# Altium project PLD.PrjPcb (part 1 of 2)
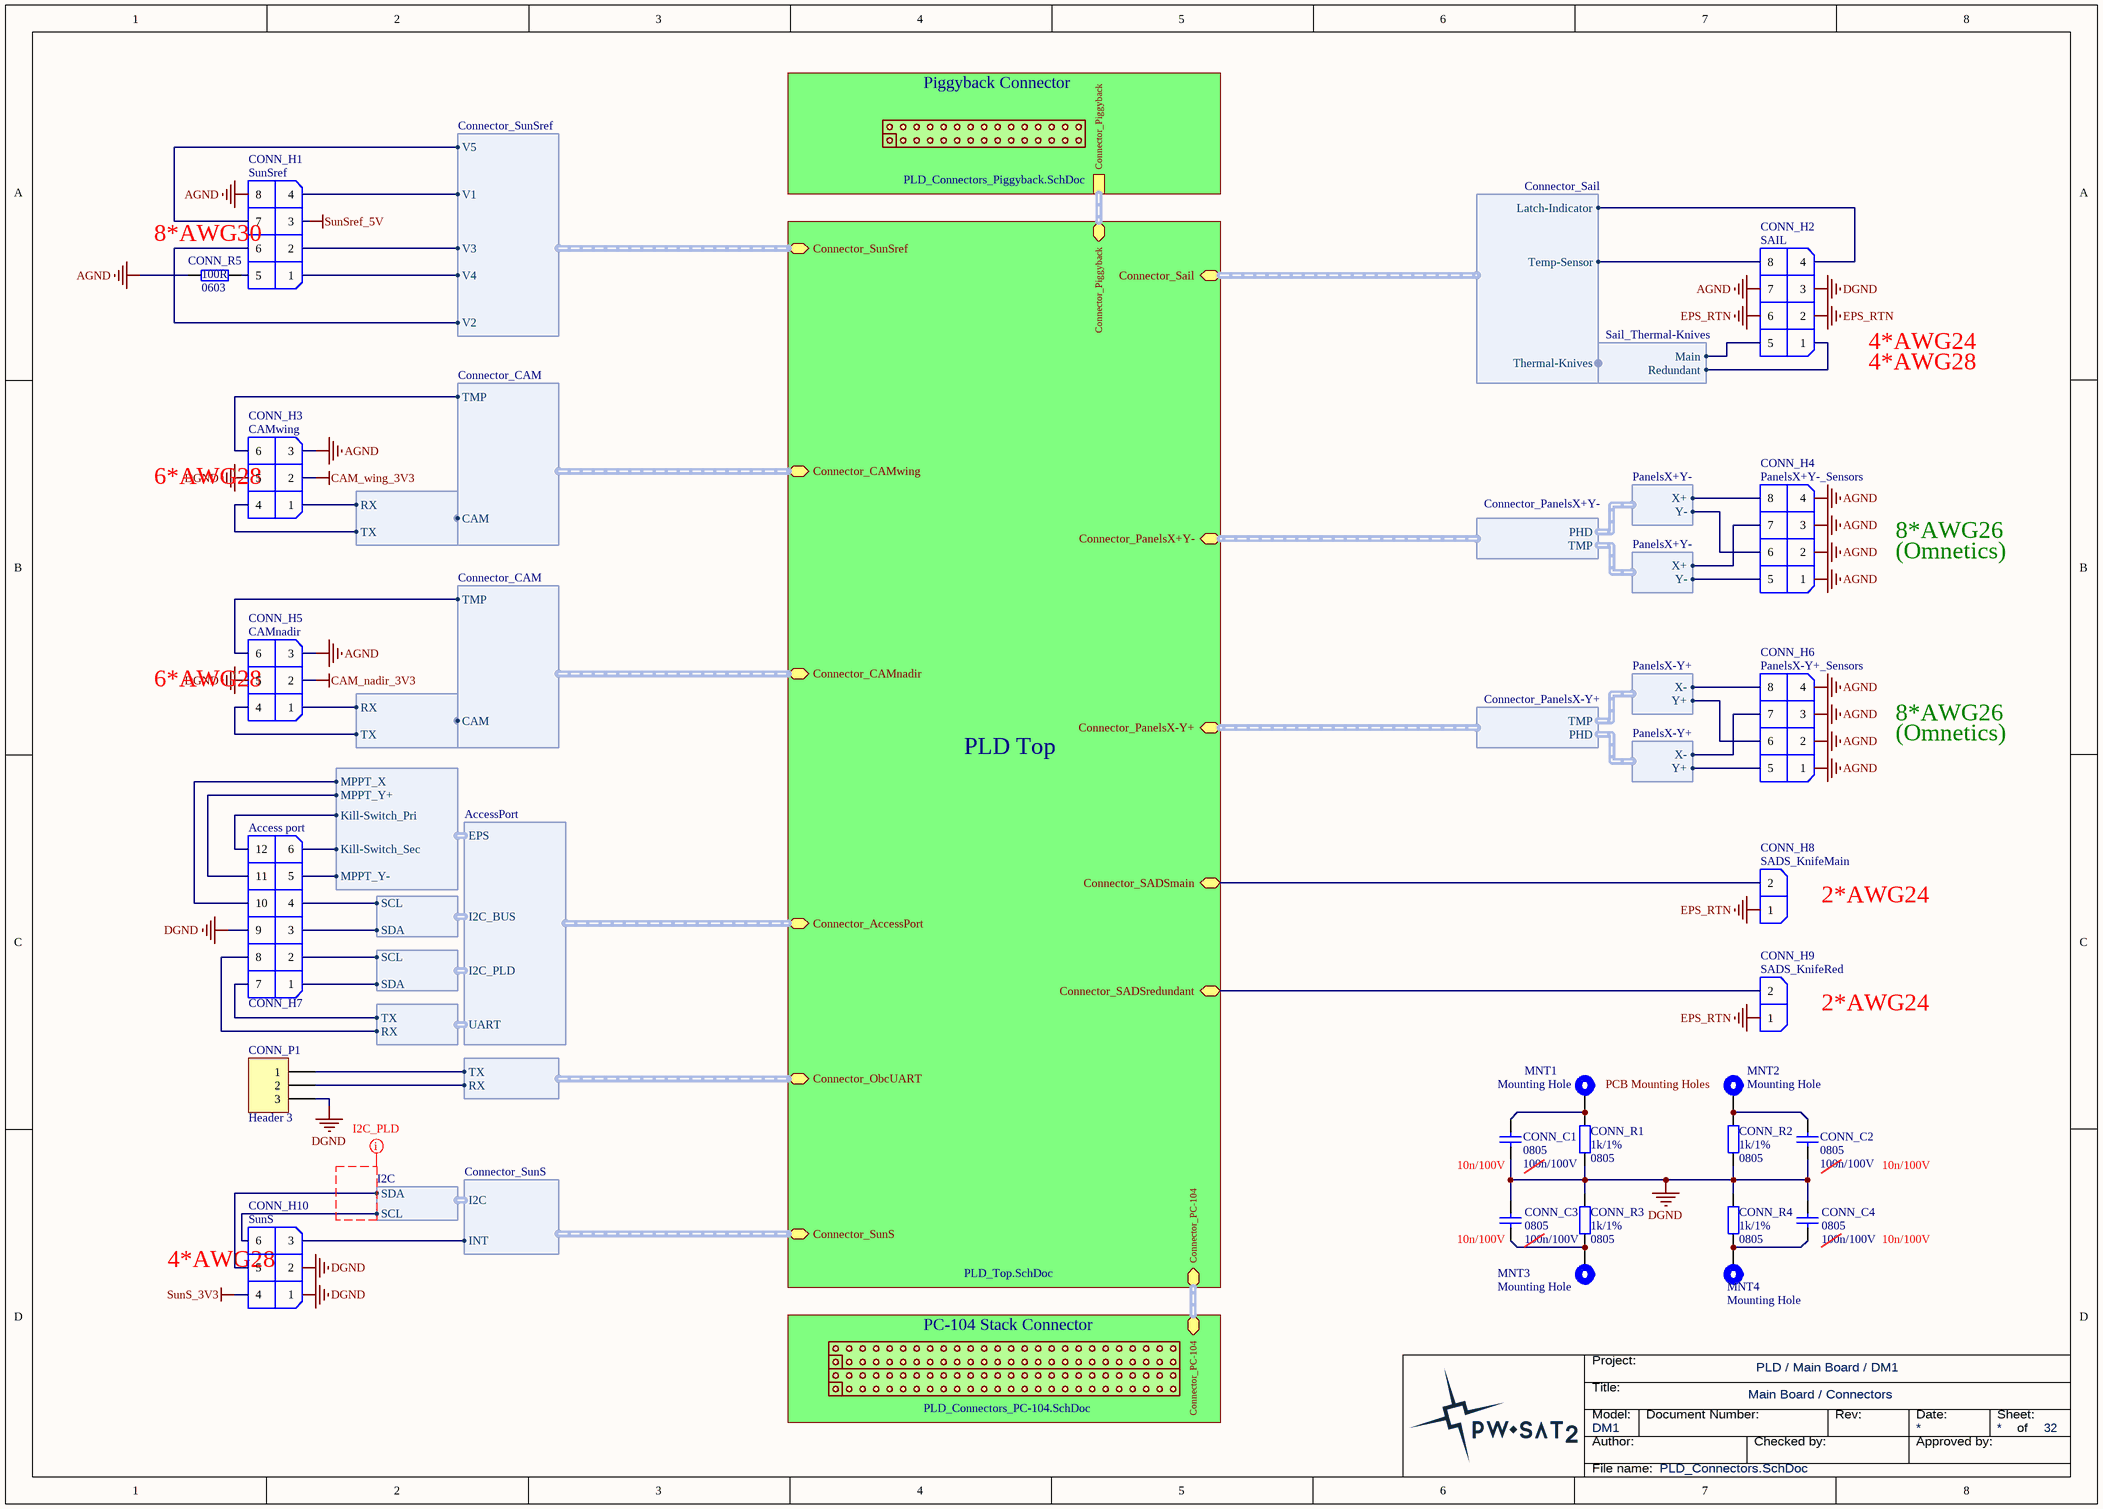
[diagram p0: PLD_Connectors.SchDoc]
ApprovedBy_Name: Piotr Kuligowski; Author_Name: Grzegorz Gajoch; CheckedBy_Name: Michal Gumiela; Equipment: Main Board; Model: DM1; PCB_Author: (pcbdoc author); PCB_CheckedBy: (not checked); PCB_DocName: Main Board; PCB_DocNo: PWSat2-xxx-DW-xxx; PCB_Id: Main Board; PCB_Revision: 1; Project_FullName: PW-Sat2; Project_Id: PLD; Project_ShortName: PLD; Schematics_DocName: Main Board; Schematics_DocNo: PWSat2-xxx-DW-xxx; Schematics_Revision: 1; Subsystem: PLD
27 sheets, 325 parts. Net scope: hierarchical (ports join the sheet entries above them; power ports are global).
Board file: PLD.PcbDoc
Sheets:
  PLD_Connectors.SchDoc
    PLD Top = PLD_Top.SchDoc
      RTC = PLD_RTC.SchDoc
      RadFET = PLD_RadFET.SchDoc
        Radfet Supply = PLD_RadFET_Supply.SchDoc
          LCL 5V = PLD_RadFET_LCL.SchDoc
          LCL 3V3d = PLD_RadFET_LCL.SchDoc
        RadFET_ADC = PLD_RadFET_ADC.SchDoc
        Current source = PLD_RadFET_Current_Source.SchDoc
        Channel selector = PLD_RadFET_Mux.SchDoc
        P-MOSFET = PLD_RadFET_Sensor.SchDoc
        Filter = PLD_RadFET_Differential_Lowpass.SchDoc
      Sail interface = PLD_Sail_interface.SchDoc
      AVR interface = PLD_Sensors_AVR_Interface.SchDoc
        Watchdog = PLD_AVR_Watchdog.SchDoc
      Photodiodes = PLD_Photodiodes.SchDoc
      SunS Ref. Interface = PLD_SunSref-Interface.SchDoc
      ADC = PLD_ADC.SchDoc
      I2C Repeater for PLD = PLD_I2C-Repeater.SchDoc
      Gyroscopes = PLD_Gyroscopes.SchDoc
      Local Supply = PLD_Local-Supply.SchDoc
      LMT87 for supply = PLD_LMT87.SchDoc
      8 CH PT1000 interface = PLD_Thermometers_PT1000.SchDoc
      Housekeeping = PLD_HK.SchDoc
      ADC MUX = PLD_ADC_MUX.SchDoc
      I2C Repeater for RTC = PLD_I2C-Repeater.SchDoc
      I2C Repeater for SunS = PLD_I2C-Repeater.SchDoc
      I2C Repeater for Gyro = PLD_I2C-Repeater.SchDoc
      MemoryInterface = PLD_MemoryInterface.SchDoc
    PC-104 Stack Connector = PLD_Connectors_PC-104.SchDoc
    Piggyback Connector = PLD_Connectors_Piggyback.SchDoc

## Sheet PLD_Connectors.SchDoc: Connectors
size A3; ApprovedBy: Piotr Kuligowski; CheckedBy: Michal Gumiela; Author: Grzegorz Gajoch; DocumentNumber: PWSat2-xxx-DW-xxx; Revision: 1; SheetTotal: 32; Model: DM1

### Parts
CONN_C1  Package: 0805  [SMD_Capacitor_0805]  (hidden comment: 100n/100V)
CONN_C2  Package: 0805  [SMD_Capacitor_0805]  (hidden comment: 100n/100V)
CONN_C3  Package: 0805  [SMD_Capacitor_0805]  (hidden comment: 100n/100V)
CONN_C4  Package: 0805  [SMD_Capacitor_0805]  (hidden comment: 100n/100V)
CONN_H1  SunSref  [Harwin_Datamate_L-Tek_M80-8670805]
CONN_H2  SAIL  [Harwin_Datamate_L-Tek_M80-8670805]
CONN_H3  CAMwing  [Harwin_Datamate_L-Tek_M80-8670605]
CONN_H4  PanelsX+Y-_Sensors  [Harwin_Datamate_L-Tek_M80-8670805]
CONN_H5  CAMnadir  [Harwin_Datamate_L-Tek_M80-8670605]
CONN_H6  PanelsX-Y+_Sensors  [Harwin_Datamate_L-Tek_M80-8670805]
CONN_H7  Access port  [Harwin_Datamate_L-Tek_M80-8411242]
CONN_H8  SADS_KnifeMain  [Harwin_Datamate_L-Tek_M80-8770222]
CONN_H9  SADS_KnifeRed  [Harwin_Datamate_L-Tek_M80-8770222]
CONN_H10  SunS  [Harwin_Datamate_L-Tek_M80-8670605]
CONN_P1  Header 3  [HEADER 1X3 FEMALE]
CONN_R1  Package: 0805  [SMD_Resistor_0805]  (hidden comment: 1k/1%)
CONN_R2  Package: 0805  [SMD_Resistor_0805]  (hidden comment: 1k/1%)
CONN_R3  Package: 0805  [SMD_Resistor_0805]  (hidden comment: 1k/1%)
CONN_R4  Package: 0805  [SMD_Resistor_0805]  (hidden comment: 1k/1%)
CONN_R5  Package: 0603  [SMD_Resistor_0603]  (hidden comment: 100R)
MNT1  Mounting Hole  [PC-104_PcbMntHole_M3]
MNT2  Mounting Hole  [PC-104_PcbMntHole_M3]
MNT3  Mounting Hole  [PC-104_PcbMntHole_M3]
MNT4  Mounting Hole  [PC-104_PcbMntHole_M3]

### Sub-sheets
PC-104 Stack Connector = PLD_Connectors_PC-104.SchDoc: Connector_PC-104 (harness Connector_PC-104)
Piggyback Connector = PLD_Connectors_Piggyback.SchDoc: Connector_Piggyback (harness Connector_Piggyback)
PLD Top = PLD_Top.SchDoc: Connector_Sail (harness Connector_Sail), Connector_PC-104 (harness Connector_PC-104), Connector_Piggyback (harness Connector_Piggyback), Connector_CAMnadir (harness Connector_CAM), Connector_PanelsX-Y+ (harness Connector_PanelsX-Y+), Connector_PanelsX+Y- (harness Connector_PanelsX+Y-), Connector_SunS (harness Connector_SunS), Connector_CAMwing (harness Connector_CAM), Connector_SADSmain, Connector_SADSredundant, Connector_SunSref (harness Connector_SunSref), Connector_AccessPort (harness AccessPort), Connector_ObcUART (harness UART)

### Harnesses
Connector_Sail: Latch-Indicator, Temp-Sensor, Thermal-Knives
Sail_Thermal-Knives: Main, Redundant
Connector_SunS: I2C, INT
I2C: SDA, SCL
CAM: TX, RX
Connector_CAM: CAM, TMP
Connector_PanelsX-Y+: PHD, TMP
PanelsX-Y+: X-, Y+
Connector_PanelsX+Y-: TMP, PHD
PanelsX+Y-: X+, Y-
Connector_SunSref: V1, V2, V3, V4, V5
AccessPort: I2C_PLD, I2C_BUS, EPS, UART
EPS_ACCESSPORT: MPPT_X, MPPT_Y+, MPPT_Y-, Kill-Switch_Pri, Kill-Switch_Sec
UART: RX, TX

### Nets
AGND: CONN_H1.8 CONN_H2.7 CONN_H3.3 CONN_H4.1 CONN_H4.2 CONN_H4.3 CONN_H4.4 CONN_H5.3 CONN_H6.1 CONN_H6.2 CONN_H6.3 CONN_H6.4 CONN_R5.1
CAM_nadir_3V3: CONN_H5.2
CAM_wing_3V3: CONN_H3.2
DGND: CONN_C1.1 CONN_C2.1 CONN_C3.2 CONN_C4.2 CONN_H2.3 CONN_H3.5 CONN_H5.5 CONN_H7.9 CONN_H10.1 CONN_H10.2 CONN_P1.3 CONN_R1.1 CONN_R2.1 CONN_R3.2 CONN_R4.2
EPS_RTN: CONN_H2.2 CONN_H2.6 CONN_H8.1 CONN_H9.1
SunS_3V3: CONN_H10.4
SunSref_5V: CONN_H1.3
IN_A: CONN_H6.7 ; harness PanelsX-Y+.X-
IN_B: CONN_H4.8 ; harness PanelsX+Y-.X+
IN_C: CONN_H6.5 ; harness PanelsX-Y+.Y+
IN_D: CONN_H4.6 ; harness PanelsX+Y-.Y-
PC-104_LCL_SADSmain: CONN_H8.2 ; sheet PLD Top/Connector_SADSmain
PC-104_LCL_SADSred: CONN_H9.2 ; sheet PLD Top/Connector_SADSredundant
PC-104_LCL_SAILmain: CONN_H2.5 ; harness Sail_Thermal-Knives.Main
PC-104_LCL_SAILred: CONN_H2.1 ; harness Sail_Thermal-Knives.Redundant
Piggyback_ADC_PD5: CONN_H10.3 ; sheet PLD Top/Connector_SunS.INT
PT1000_SAIL: CONN_H2.8 ; sheet PLD Top/Connector_Sail.Temp-Sensor
NetCONN_C1_2: CONN_C1.2 CONN_R1.2 MNT1.1
NetCONN_C2_2: CONN_C2.2 CONN_R2.2 MNT2.1
NetCONN_C3_1: CONN_C3.1 CONN_R3.1 MNT3.1
NetCONN_C4_1: CONN_C4.1 CONN_R4.1 MNT4.1
NetCONN_H1_1: CONN_H1.1 ; sheet PLD Top/Connector_SunSref.V4
NetCONN_H1_2: CONN_H1.2 ; sheet PLD Top/Connector_SunSref.V3
NetCONN_H1_4: CONN_H1.4 ; sheet PLD Top/Connector_SunSref.V1
NetCONN_H1_5: CONN_H1.5 CONN_R5.2
NetCONN_H1_6: CONN_H1.6 ; sheet PLD Top/Connector_SunSref.V2
NetCONN_H1_7: CONN_H1.7 ; sheet PLD Top/Connector_SunSref.V5
NetCONN_H2_4: CONN_H2.4 ; sheet PLD Top/Connector_Sail.Latch-Indicator
NetCONN_H3_1: CONN_H3.1 ; harness CAM.RX
NetCONN_H3_4: CONN_H3.4 ; harness CAM.TX
NetCONN_H3_6: CONN_H3.6 ; sheet PLD Top/Connector_CAMwing.TMP
NetCONN_H4_5: CONN_H4.5 ; harness PanelsX+Y-.Y-
NetCONN_H4_7: CONN_H4.7 ; harness PanelsX+Y-.X+
NetCONN_H5_1: CONN_H5.1 ; harness CAM.RX
NetCONN_H5_4: CONN_H5.4 ; harness CAM.TX
NetCONN_H5_6: CONN_H5.6 ; sheet PLD Top/Connector_CAMnadir.TMP
NetCONN_H6_6: CONN_H6.6 ; harness PanelsX-Y+.Y+
NetCONN_H6_8: CONN_H6.8 ; harness PanelsX-Y+.X-
NetCONN_H7_1: CONN_H7.1 ; harness I2C.SDA
NetCONN_H7_2: CONN_H7.2 ; harness I2C.SCL
NetCONN_H7_3: CONN_H7.3 ; harness I2C.SDA
NetCONN_H7_4: CONN_H7.4 ; harness I2C.SCL
NetCONN_H7_5: CONN_H7.5 ; harness EPS_ACCESSPORT.MPPT_Y-
NetCONN_H7_6: CONN_H7.6 ; harness EPS_ACCESSPORT.Kill-Switch_Sec
NetCONN_H7_7: CONN_H7.7 ; harness UART.TX
NetCONN_H7_8: CONN_H7.8 ; harness UART.RX
NetCONN_H7_10: CONN_H7.10 ; harness EPS_ACCESSPORT.MPPT_X
NetCONN_H7_11: CONN_H7.11 ; harness EPS_ACCESSPORT.MPPT_Y+
NetCONN_H7_12: CONN_H7.12 ; harness EPS_ACCESSPORT.Kill-Switch_Pri
NetCONN_H10_5: CONN_H10.5 ; harness I2C.SDA
NetCONN_H10_6: CONN_H10.6 ; harness I2C.SCL
NetCONN_P1_1: CONN_P1.1 ; sheet PLD Top/Connector_ObcUART.TX
NetCONN_P1_2: CONN_P1.2 ; sheet PLD Top/Connector_ObcUART.RX

### Buses and harness runs
harness sheet PC-104 Stack Connector/Connector_PC-104 = sheet PLD Top/Connector_PC-104
harness sheet Piggyback Connector/Connector_Piggyback = sheet PLD Top/Connector_Piggyback

### Layout directives
net class I2C_PLD: (no net found under the mark)

### Notes on the sheet
- 8*AWG30
- 4*AWG24
- 4*AWG28
- 6*AWG28
- 8*AWG26
- (Omnetics)
- 2*AWG24
- PCB Mounting Holes
- (near CONN_C1) 10n/100V
- 10n/100V
- (near CONN_C3) 10n/100V
- Title:
- Project:
- Author:
- Model:
- Document Number:
- Checked by:
- Rev:
- Date:
- Approved by:
- Sheet:
- of
- File name:

### Library data of the parts
CONN_C1-CONN_C4 = Cer_C0805T104K1RCLTU: Ceramic Cap Kemet COTS 100n/100V X7R 0805; ManufacturerPartNumber: C0805T104K1RCLTU; Manufacturer: Kemet; Value: 100n/100V
CONN_H1 CONN_H2 CONN_H4 CONN_H6 = Harwin_Datamate_L-Tek_2x4pin: Harwin DataMate L-Tek, 2mm pitch, 2x4pin.; Value: Harwin DataMate L-Tek 2x4pin
CONN_H3 CONN_H5 CONN_H10 = Harwin_Datamate_L-Tek_2x3pin: Harwin DataMate L-Tek, 2mm pitch, 2x3pin.; Value: Harwin DataMate L-Tek 2x3pin
CONN_H7 = Harwin_Datamate_L-Tek_2x6pin: Harwin DataMate L-Tek, 2mm pitch, 2x6pin.; Value: Harwin DataMate L-Tek 2x6pin
CONN_H8 CONN_H9 = Harwin_Datamate_L-Tek_1x2pin: Harwin DataMate L-Tek, 2mm pitch, 1x2pin.; Value: Harwin DataMate L-Tek 1x2pin
CONN_P1 = Header 3: Header, 3-Pin; LatestRevisionDate: 17-Jul-2002; LatestRevisionNote: Re-released for DXP Platform.; Publisher: Altium Limited
CONN_R1-CONN_R4 = CRCW08051K00FKxxxx: 1k/1% Vishay CRCW 0805 Resistor. 125mW, 100ppm, 150V.; Manufacturer: Vishay; ManufacturerPartNumber: CRCW08051K00FKxxxx; Value: 1k/1%
CONN_R5 = Res: Value: 100R
MNT1-MNT4 = MntHole: PCB Mounting Hole; Value: Mounting Hole

## Sheet PLD_Top.SchDoc: Top
size A2; ApprovedBy: Piotr Kuligowski; CheckedBy: Michal Gumiela; Author: Grzegorz Gajoch; DocumentNumber: PWSat2-xxx-DW-xxx; Revision: 1; SheetTotal: 32; Model: DM1
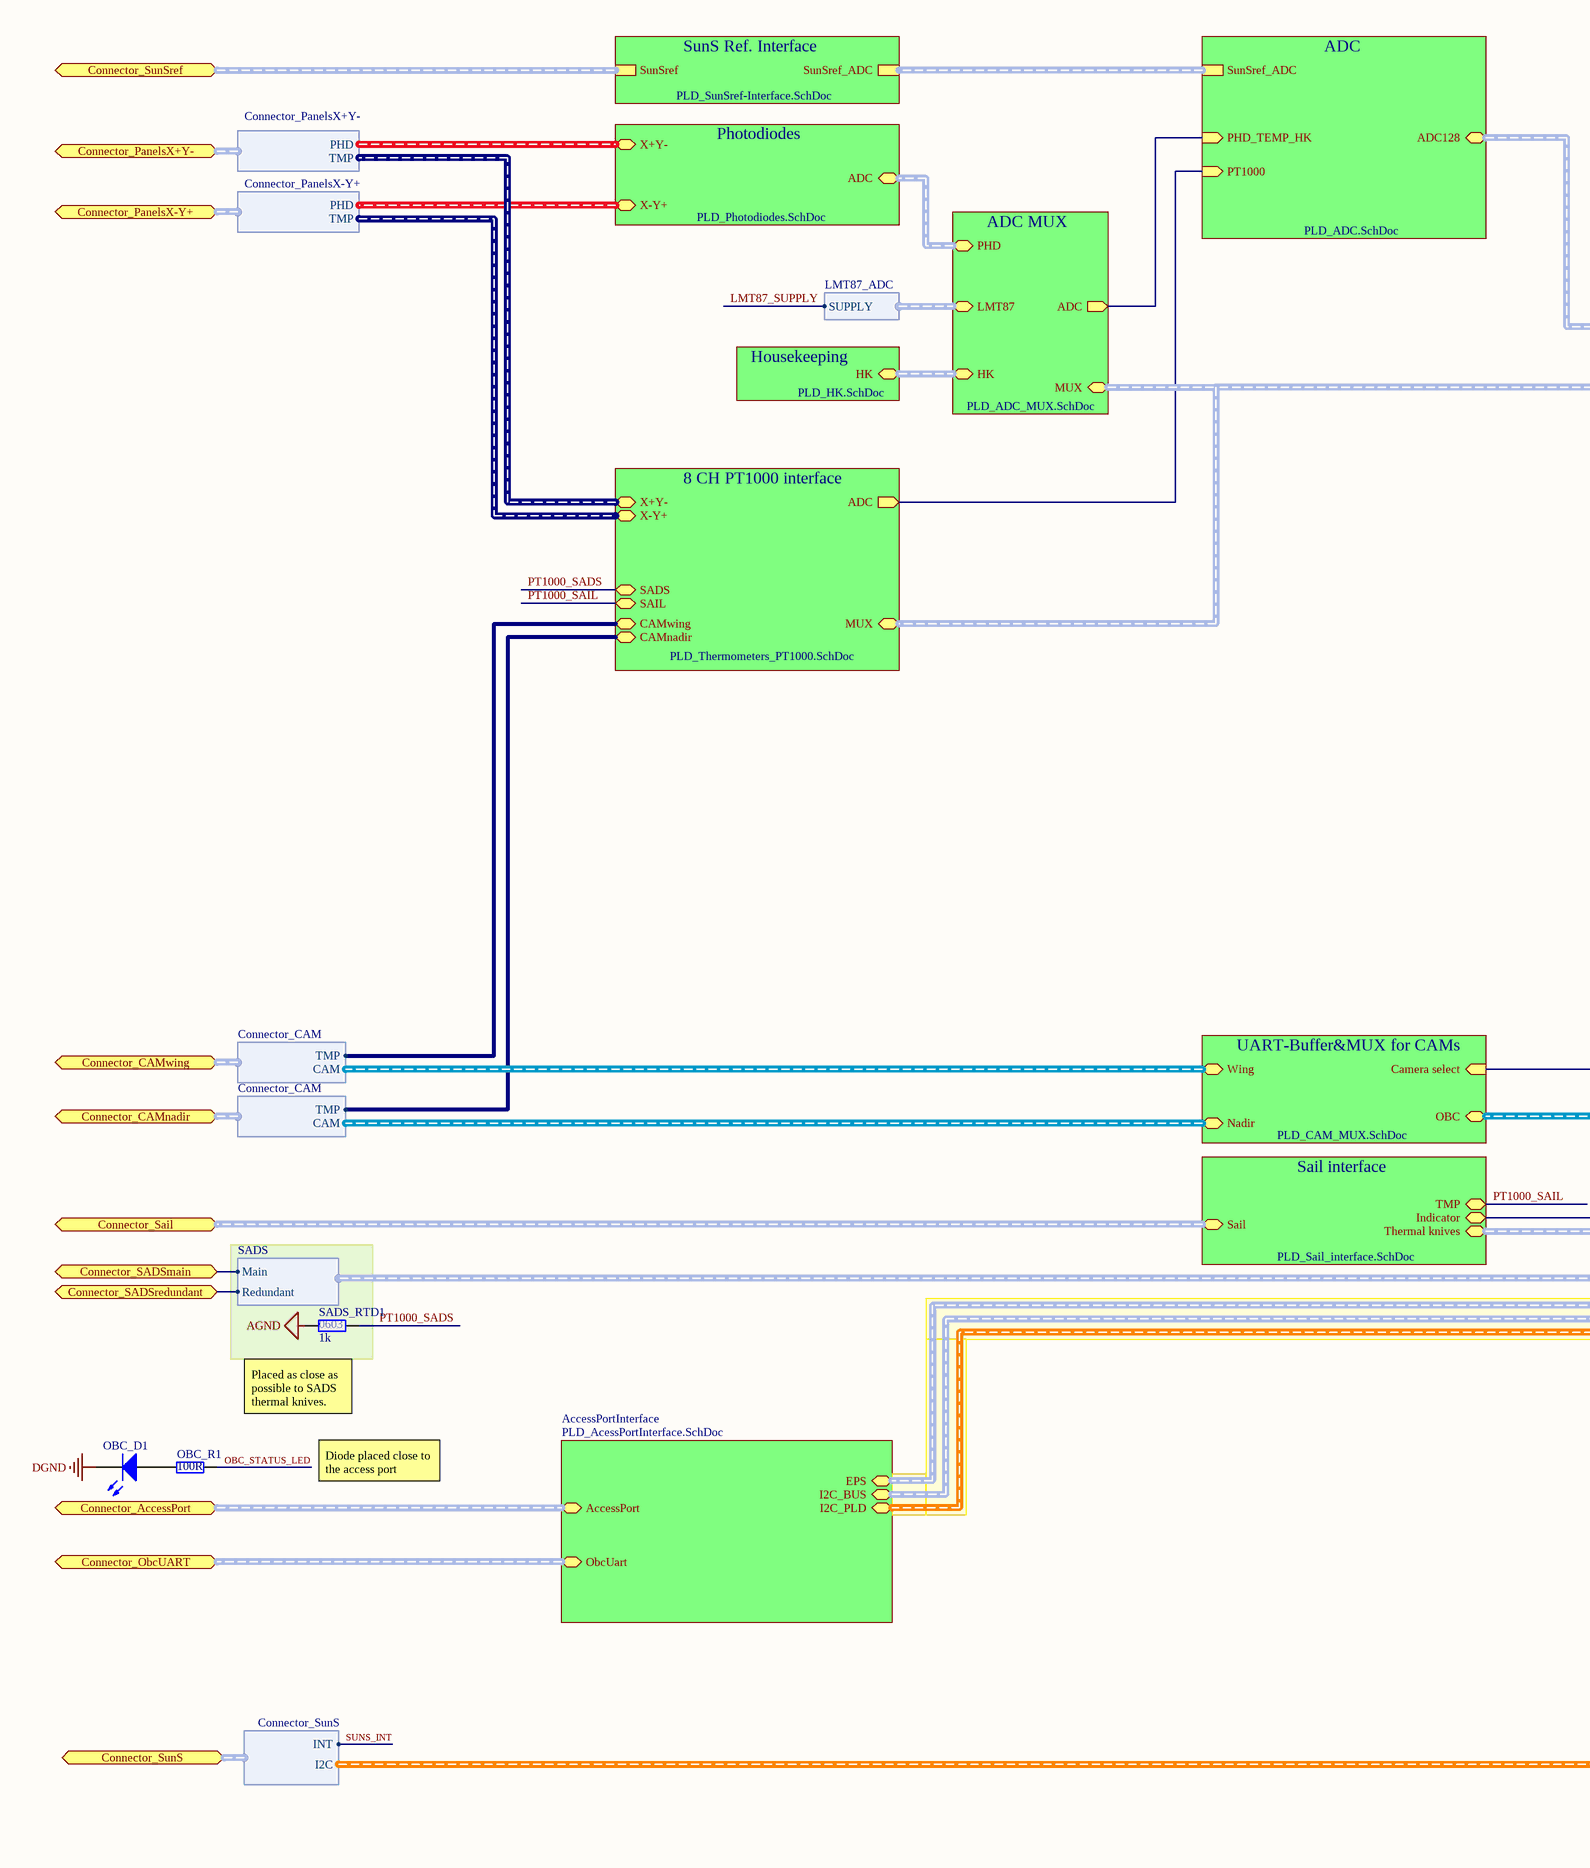
[diagram p1: PLD_Top.SchDoc, left]
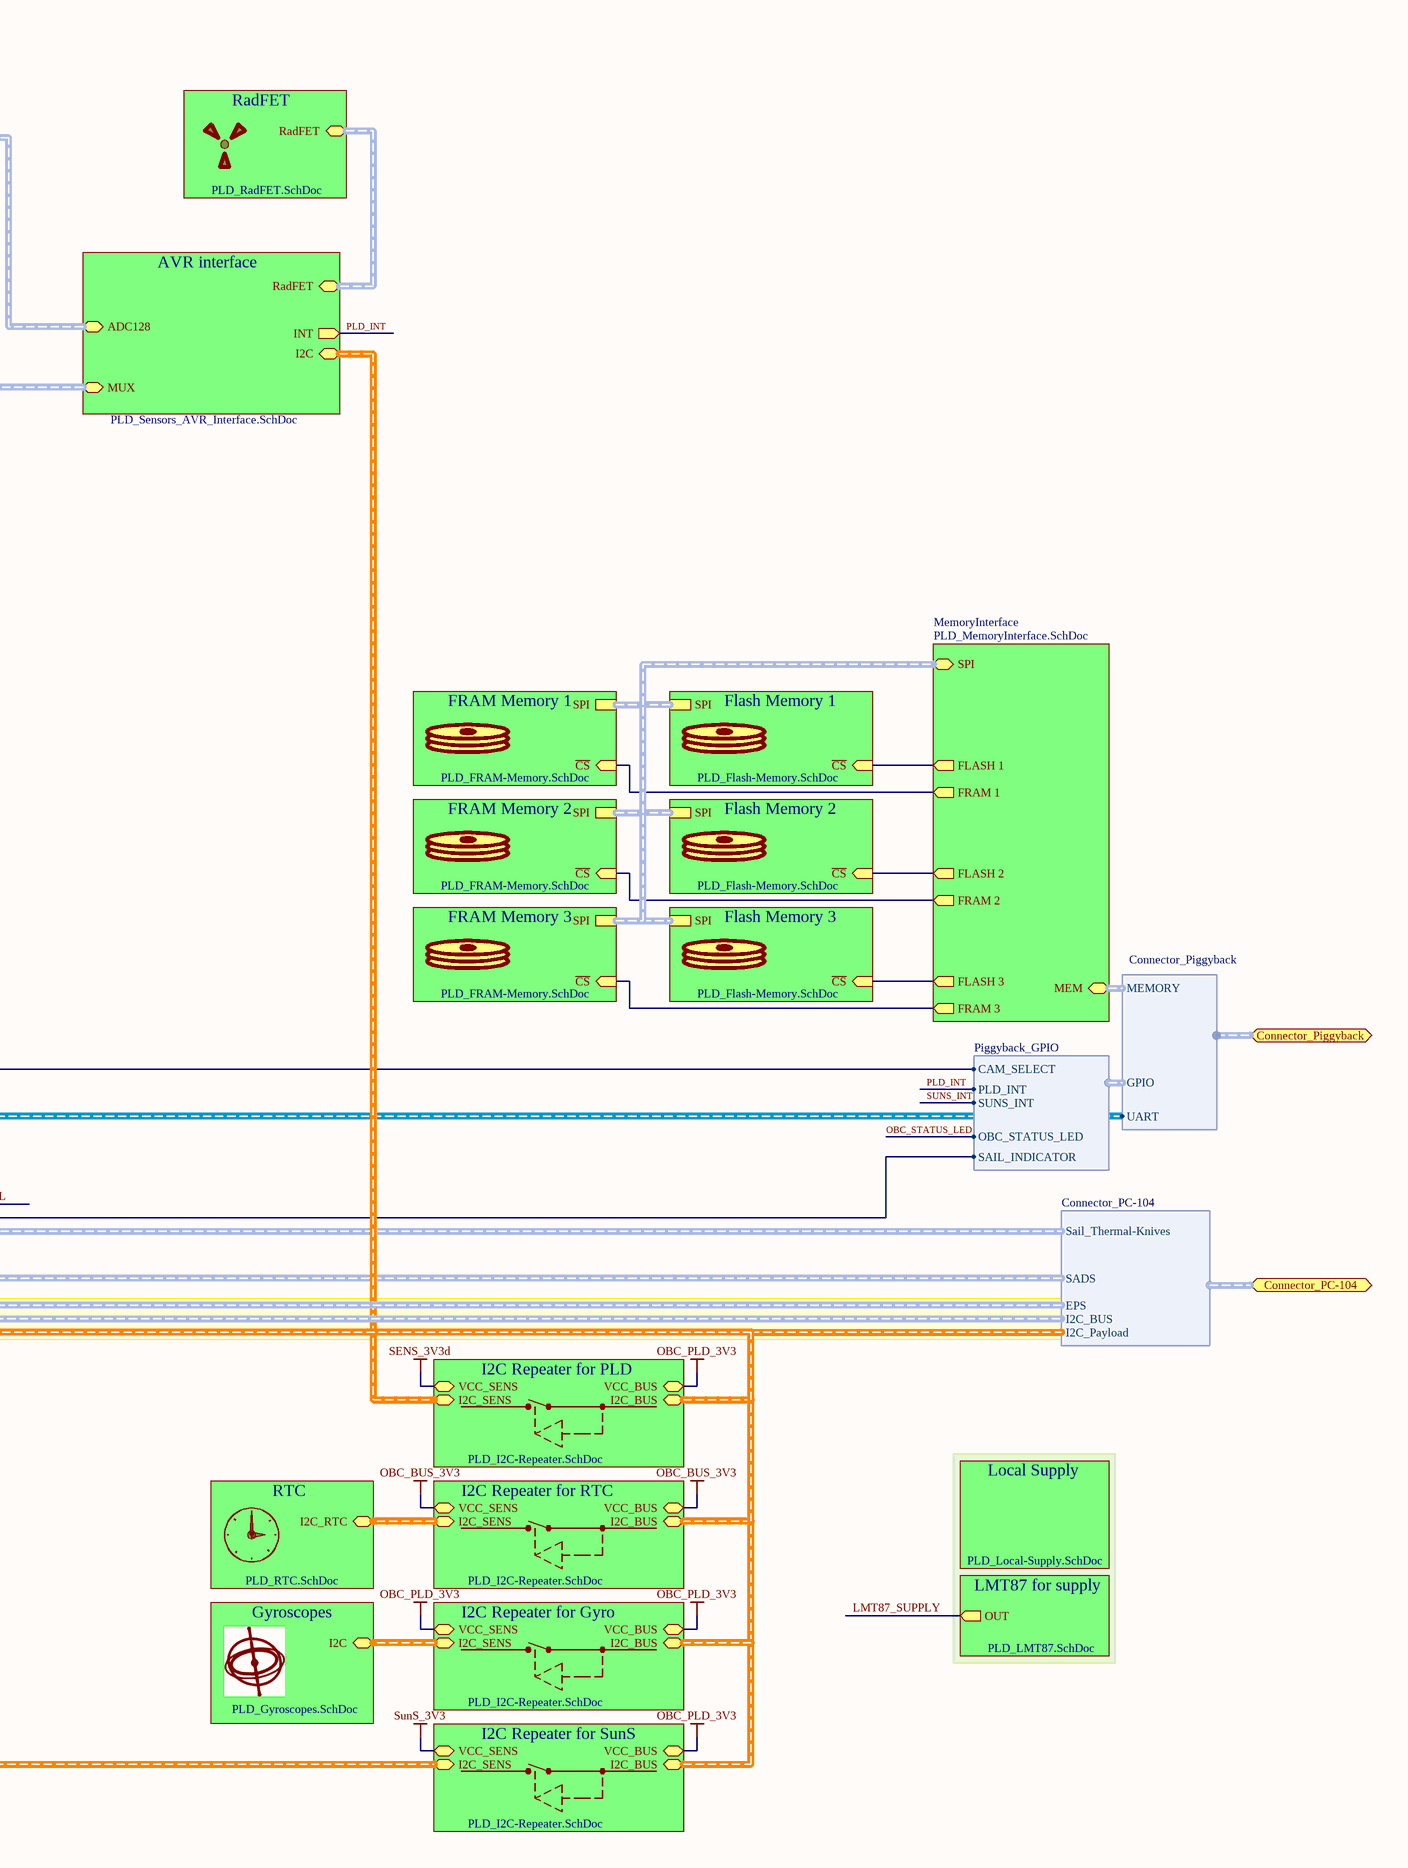
[diagram p2: PLD_Top.SchDoc, right]

### Parts
OBC_D1  LEDX  [LED 0805 Blue]  (value not drawn)
OBC_R1  100R  [SMD_Resistor_0603]
SADS_RTD1  Package: 0603  [SMD_Resistor_0603]  (hidden comment: 1k)

### Sub-sheets
8 CH PT1000 interface = PLD_Thermometers_PT1000.SchDoc: MUX (harness MUX), ADC (out), CAMwing, CAMnadir, X-Y+ (harness PanelsX-Y+), X+Y- (harness PanelsX+Y-), SADS (bidir), SAIL (bidir)
AccessPortInterface = PLD_AcessPortInterface.SchDoc (file not in this document): AccessPort (harness AccessPort), ObcUart (harness UART), I2C_BUS (harness I2C), I2C_PLD (harness I2C), EPS (harness EPS_ACCESSPORT)
ADC = PLD_ADC.SchDoc: SunSref_ADC (harness SunSref_ADC), PHD_TEMP_HK (in), PT1000 (in), ADC128 (harness ADC128)
ADC MUX = PLD_ADC_MUX.SchDoc: LMT87 (harness LMT87_ADC), HK (harness HK_ADC), ADC (out), MUX (harness MUX), PHD (harness PHD_ADC)
AVR interface = PLD_Sensors_AVR_Interface.SchDoc: I2C (harness I2C), RadFET (harness RadFET), ADC128 (harness ADC128), MUX (harness MUX), INT (out)
Flash Memory 1 = PLD_Flash-Memory.SchDoc (file not in this document): SPI (harness SPI), ~{CS} (in)
Flash Memory 2 = PLD_Flash-Memory.SchDoc (file not in this document): SPI (harness SPI), ~{CS} (in)
Flash Memory 3 = PLD_Flash-Memory.SchDoc (file not in this document): SPI (harness SPI), ~{CS} (in)
FRAM Memory 1 = PLD_FRAM-Memory.SchDoc (file not in this document): SPI (harness SPI), ~{CS} (in)
FRAM Memory 2 = PLD_FRAM-Memory.SchDoc (file not in this document): SPI (harness SPI), ~{CS} (in)
FRAM Memory 3 = PLD_FRAM-Memory.SchDoc (file not in this document): SPI (harness SPI), ~{CS} (in)
Gyroscopes = PLD_Gyroscopes.SchDoc: I2C (harness I2C)
Housekeeping = PLD_HK.SchDoc: HK (harness HK_ADC)
I2C Repeater for Gyro = PLD_I2C-Repeater.SchDoc: I2C_BUS (harness I2C), VCC_SENS, VCC_BUS, I2C_SENS (harness I2C)
I2C Repeater for PLD = PLD_I2C-Repeater.SchDoc: I2C_BUS (harness I2C), VCC_SENS, VCC_BUS, I2C_SENS (harness I2C)
I2C Repeater for RTC = PLD_I2C-Repeater.SchDoc: I2C_BUS (harness I2C), VCC_SENS, VCC_BUS, I2C_SENS (harness I2C)
I2C Repeater for SunS = PLD_I2C-Repeater.SchDoc: I2C_BUS (harness I2C), VCC_SENS, VCC_BUS, I2C_SENS (harness I2C)
LMT87 for supply = PLD_LMT87.SchDoc: OUT (out)
Local Supply = PLD_Local-Supply.SchDoc: no entries
MemoryInterface = PLD_MemoryInterface.SchDoc: FLASH 1 (out), SPI (harness SPI), FRAM 1 (out), FLASH 2 (out), FLASH 3 (out), FRAM 2 (out), FRAM 3 (out), MEM (harness MEMORY)
Photodiodes = PLD_Photodiodes.SchDoc: X-Y+ (harness PanelsX-Y+), X+Y- (harness PanelsX+Y-), ADC (harness PHD_ADC)
RadFET = PLD_RadFET.SchDoc: RadFET (harness RadFET)
RTC = PLD_RTC.SchDoc: I2C_RTC (harness I2C)
Sail interface = PLD_Sail_interface.SchDoc: TMP (bidir), Indicator, Sail (harness Connector_Sail), Thermal knives (harness Sail_Thermal-Knives)
SunS Ref. Interface = PLD_SunSref-Interface.SchDoc: SunSref (harness Connector_SunSref), SunSref_ADC (harness SunSref_ADC)
UART-Buffer&MUX for CAMs = PLD_CAM_MUX.SchDoc (file not in this document): Camera select (in), OBC (harness UART), Wing (harness CAM), Nadir (harness CAM)

### Ports
Connector_AccessPort (harness AccessPort), Connector_CAMnadir (harness Connector_CAM), Connector_CAMwing (harness Connector_CAM), Connector_ObcUART (harness UART), Connector_PanelsX+Y- (harness Connector_PanelsX+Y-), Connector_PanelsX-Y+ (harness Connector_PanelsX-Y+), Connector_PC-104 (harness Connector_PC-104), Connector_Piggyback (harness Connector_Piggyback), Connector_SADSmain, Connector_SADSredundant, Connector_Sail (harness Connector_Sail), Connector_SunS (harness Connector_SunS), Connector_SunSref (harness Connector_SunSref)

### Harnesses
Connector_CAM: CAM, TMP
Connector_PanelsX+Y-: TMP, PHD
Connector_PanelsX-Y+: PHD, TMP
Connector_PC-104: I2C_Payload, Sail_Thermal-Knives, SADS, I2C_BUS, EPS
SADS: Main, Redundant
LMT87_ADC: SUPPLY
Connector_SunS: I2C, INT
Connector_Piggyback: UART, GPIO, MEMORY
Piggyback_GPIO: CAM_SELECT, PLD_INT, SAIL_INDICATOR, SUNS_INT, OBC_STATUS_LED

### Nets
AGND: SADS_RTD1.1
DGND: OBC_D1.2(K)
OBC_BUS_3V3: sheet I2C Repeater for RTC/VCC_SENS, sheet I2C Repeater for RTC/VCC_BUS
OBC_PLD_3V3: sheet I2C Repeater for PLD/VCC_BUS, sheet I2C Repeater for SunS/VCC_BUS, sheet I2C Repeater for Gyro/VCC_SENS, sheet I2C Repeater for Gyro/VCC_BUS
FLASH1_R: sheet Flash Memory 1/~{CS}, sheet MemoryInterface/FLASH 1
FLASH2_R: sheet Flash Memory 2/~{CS}, sheet MemoryInterface/FLASH 2
FLASH3_R: sheet Flash Memory 3/~{CS}, sheet MemoryInterface/FLASH 3
FRAM1_R: sheet FRAM Memory 1/~{CS}, sheet MemoryInterface/FRAM 1
FRAM2_R: sheet FRAM Memory 2/~{CS}, sheet MemoryInterface/FRAM 2
FRAM3_R: sheet FRAM Memory 3/~{CS}, sheet MemoryInterface/FRAM 3
LMT87_SUPPLY: sheet LMT87 for supply/OUT, sheet ADC MUX/LMT87.SUPPLY
OBC_STATUS_LED: OBC_R1.2 ; harness Piggyback_GPIO.OBC_STATUS_LED
PC-104_LCL_SADSmain: port Connector_SADSmain, harness SADS.Main
PC-104_LCL_SADSred: port Connector_SADSredundant, harness SADS.Redundant
Piggyback_ADC_PD4: sheet Sail interface/Indicator, harness Piggyback_GPIO.SAIL_INDICATOR
Piggyback_GPIO_PB12: sheet UART-Buffer&MUX for CAMs/Camera select, harness Piggyback_GPIO.CAM_SELECT
PLD_INT: sheet AVR interface/INT, harness Piggyback_GPIO.PLD_INT  [project net INT]
PT1000_SADS: SADS_RTD1.2 ; sheet 8 CH PT1000 interface/SADS
PT1000_SAIL: sheet Sail interface/TMP, sheet 8 CH PT1000 interface/SAIL
SUNS_INT: port Connector_SunS.INT, harness Piggyback_GPIO.SUNS_INT  [project net Piggyback_ADC_PD5]
NetADC_C7_1: sheet ADC/PHD_TEMP_HK, sheet ADC MUX/ADC
NetADC_C8_1: sheet ADC/PT1000, sheet 8 CH PT1000 interface/ADC
NetCONN_H3_6: sheet 8 CH PT1000 interface/CAMwing, port Connector_CAMwing.TMP
NetCONN_H5_6: sheet 8 CH PT1000 interface/CAMnadir, port Connector_CAMnadir.TMP
NetOBC_D1_1: OBC_D1.1(A) OBC_R1.1

### Buses and harness runs
harness port Connector_AccessPort = sheet AccessPortInterface/AccessPort
harness port Connector_ObcUART = sheet AccessPortInterface/ObcUart
harness port Connector_Sail = sheet Sail interface/Sail
harness port Connector_SunSref = sheet SunS Ref. Interface/SunSref
harness sheet 8 CH PT1000 interface/MUX = sheet ADC MUX/MUX = sheet AVR interface/MUX
harness sheet AccessPortInterface/I2C_PLD = sheet I2C Repeater for Gyro/I2C_BUS = sheet I2C Repeater for PLD/I2C_BUS = sheet I2C Repeater for RTC/I2C_BUS = sheet I2C Repeater for SunS/I2C_BUS
harness sheet ADC MUX/HK = sheet Housekeeping/HK
harness sheet ADC MUX/PHD = sheet Photodiodes/ADC
harness sheet ADC/ADC128 = sheet AVR interface/ADC128
harness sheet ADC/SunSref_ADC = sheet SunS Ref. Interface/SunSref_ADC
harness sheet AVR interface/I2C = sheet I2C Repeater for PLD/I2C_SENS
harness sheet AVR interface/RadFET = sheet RadFET/RadFET
harness sheet Flash Memory 1/SPI = sheet Flash Memory 2/SPI = sheet Flash Memory 3/SPI = sheet FRAM Memory 1/SPI = sheet FRAM Memory 2/SPI = sheet FRAM Memory 3/SPI = sheet MemoryInterface/SPI
harness sheet Gyroscopes/I2C = sheet I2C Repeater for Gyro/I2C_SENS
harness sheet I2C Repeater for RTC/I2C_SENS = sheet RTC/I2C_RTC

### Notes on the sheet
- (near SADS_RTD1) Placed as close as possible to SADS thermal knives.
- Diode placed close to the access port
- Title:
- Project:
- Author:
- Model:
- File name:
- Document Number:
- Checked by:
- Rev:
- Date:
- Approved by:
- Sheet:
- of

### Library data of the parts
OBC_D1 = LEDX: Typical LED
OBC_R1 = Res: Value: 100R; Package: 0603
SADS_RTD1 = PTS060301B100RP100: PT1000 Vishay PTS060301B100RP100; Manufacturer: Vishay; ManufacturerPartNumber: PTS060301B100RP100; Value: 1k

## Sheet PLD_RTC.SchDoc: RTC
size A4; ApprovedBy: Piotr Kuligowski; CheckedBy: Michal Gumiela; Author: Grzegorz Gajoch; DocumentNumber: PWSat2-xxx-DW-xxx; Revision: 1; SheetTotal: 32; Model: DM1
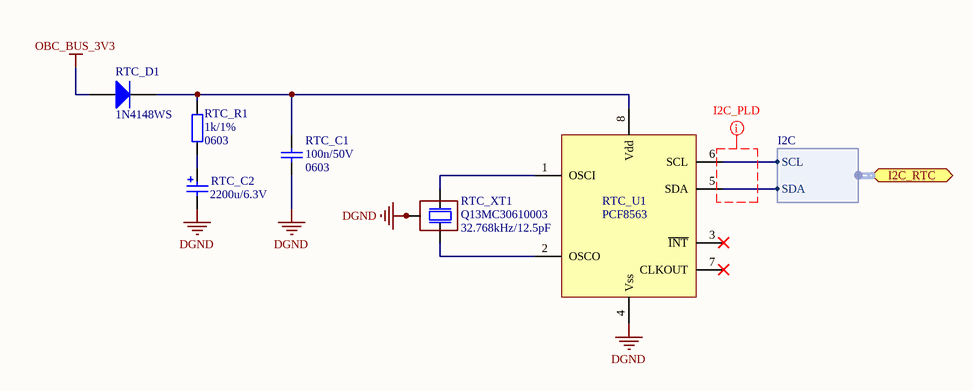
[diagram p3: PLD_RTC.SchDoc]

### Parts
RTC_C1  Package: 0603  [SMD_Capacitor_0603]  (hidden comment: 100n/50V)
RTC_C2  2200u/6.3V  [Tant_592D_X]
RTC_D1  1N4148WS  [SOD323]
RTC_R1  Package: 0603  [SMD_Resistor_0603]  (hidden comment: 1k/1%)
RTC_U1  (no value)  [TSSOP8_L]
RTC_XT1  32.768kHz/12.5pF  [Epson_MC-306]

### Ports
I2C_RTC (harness I2C)

### Harnesses
I2C: SDA, SCL

### Nets
DGND: RTC_C1.2 RTC_C2.2 RTC_U1.4(Vss) RTC_XT1.2(NC) RTC_XT1.3(NC)
OBC_BUS_3V3: RTC_D1.A
NetI3_I2C_Repeater_for_RTC_1: RTC_U1.6(SCL) ; port I2C_RTC.SCL
NetI6_I2C_Repeater_for_RTC_1: RTC_U1.5(SDA) ; port I2C_RTC.SDA
NetRTC_C1_1: RTC_C1.1 RTC_D1.K RTC_R1.1 RTC_U1.8(Vdd)
NetRTC_C2_1: RTC_C2.1 RTC_R1.2
NetRTC_U1_1: RTC_U1.1(OSCI) RTC_XT1.1(inp)
NetRTC_U1_2: RTC_U1.2(OSCO) RTC_XT1.4(out)

Not connected (* = marked no-connect by the designer): RTC_U1 3(~{INT})* 7(CLKOUT)*

### Layout directives
net class I2C_PLD: (no net found under the mark)

### Notes on the sheet
- Title:
- Project:
- Author:
- Model:
- Document Number:
- Checked by:
- Rev:
- Date:
- Approved by:
- Sheet:
- of
- File name:

### Library data of the parts
RTC_C1 = Cer_C0603T104K5RALTU: Ceramic Cap Kemet COTS 100n/50V X7R 0603; Manufacturer: Kemet; ManufacturerPartNumber: C0603T104K5RALTU; Value: 100n/50V
RTC_C2 = Tant_592D228X96R3X2T20H: Vishay 592D Solid Tantalum Chip Capacitors.; ManufacturerPartNumber: 592D228X96R3X2T20H; Manufacturer: Vishay; Value: 2200u/6.3V
RTC_D1 = 1N4148WS: Small Signal Fast Switching Diode; Manufacturer: Vishay; Value: 1N4148WS
RTC_R1 = CRCW06031K00FKxxxx: 1k/1% Vishay CRCW 0603 Resistor. 100mW, 100ppm, 75V.; Manufacturer: Vishay; ManufacturerPartNumber: CRCW06031K00FKxxxx; Value: 1k/1%
RTC_U1 = PCF8563: Real-time clock/calendar; Manufacturer: NXP; HelpUrl: http://www.nxp.com/documents/data_sheet/PCF8563.pdf; ManufacturerPartNumber: PCF8563
RTC_XT1 = Q13MC30610003: EPSON MC-306 32.768KHZ 12.5pF Crystal; Manufacturer: Epson; ManufacturerPartNumber: Q13MC30610003; Value: 32.768kHz/12.5pF

## Sheet PLD_RadFET.SchDoc: RadFET
size A4; ApprovedBy: Piotr Kuligowski; CheckedBy: Michal Gumiela; Author: Grzegorz Gajoch; DocumentNumber: PWSat2-xxx-DW-xxx; Revision: 1; SheetTotal: 32; Model: DM1
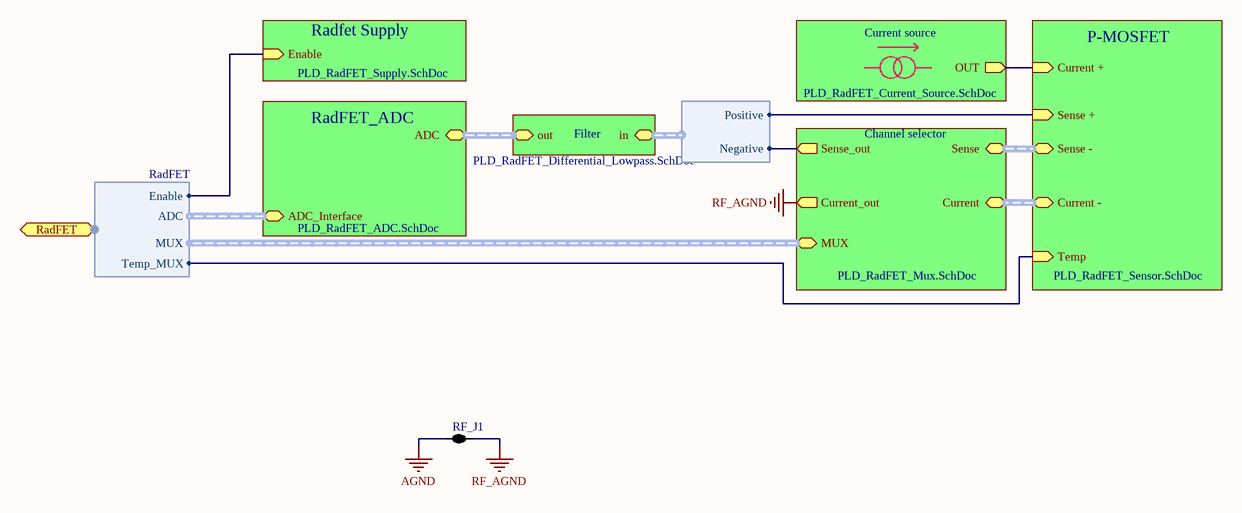
[diagram p4: PLD_RadFET.SchDoc]

### Parts
RF_J1  2 way net tie junction  [2way_LP]  (value not drawn)  (net tie, no BOM)

### Sub-sheets
Channel selector = PLD_RadFET_Mux.SchDoc: Sense_out (out), Sense (harness ADG709_MUX_CH), Current (harness ADG709_MUX_CH), MUX (harness ADG709_MUX), Current_out (out)
Current source = PLD_RadFET_Current_Source.SchDoc: OUT (out)
Filter = PLD_RadFET_Differential_Lowpass.SchDoc: in (harness ADC Channel), out (harness ADC Channel)
P-MOSFET = PLD_RadFET_Sensor.SchDoc: Sense + (in), Current + (in), Current - (harness ADG709_MUX_CH), Sense - (harness ADG709_MUX_CH), Temp (in)
Radfet Supply = PLD_RadFET_Supply.SchDoc: Enable (in)
RadFET_ADC = PLD_RadFET_ADC.SchDoc: ADC (harness ADC Channel), ADC_Interface (harness ADC_DIGITAL)

### Ports
RadFET (harness RadFET)

### Harnesses
RadFET: ADC, MUX, Enable, Temp_MUX
ADC Channel: Positive, Negative

### Nets
AGND: RF_J1.1
RF_AGND: RF_J1.2 ; sheet Channel selector/Current_out
JFET_CURRENT: sheet Current source/OUT, sheet P-MOSFET/Current +
RadFET_EN: sheet Radfet Supply/Enable, port RadFET.Enable
RadFET_Temp_MUX: sheet P-MOSFET/Temp, port RadFET.Temp_MUX
NetRF_J2_1: sheet P-MOSFET/Sense +, sheet Filter/in.Positive
NetRF_R15_1: sheet Channel selector/Sense_out, sheet Filter/in.Negative

### Buses and harness runs
harness sheet Channel selector/Current = sheet P-MOSFET/Current -
harness sheet Channel selector/Sense = sheet P-MOSFET/Sense -
harness sheet Filter/out = sheet RadFET_ADC/ADC

### Notes on the sheet
- Title:
- Project:
- Author:
- Model:
- Document Number:
- Checked by:
- Rev:
- Date:
- Approved by:
- Sheet:
- of
- File name:

### Library data of the parts
RF_J1 = 2way: ComponentLink1URL: http://www.edatools.cz/addons; ComponentLink1Description: Source; FootprintNote: LP=12mil, MP=40mil, HP=120mil

## Sheet PLD_RadFET_Supply.SchDoc: Local Supply
size A3; ApprovedBy: Piotr Kuligowski; CheckedBy: Michal Gumiela; Author: Grzegorz Gajoch; DocumentNumber: PWSat2-xxx-DW-xxx; Revision: 1; SheetTotal: 32; Model: DM1
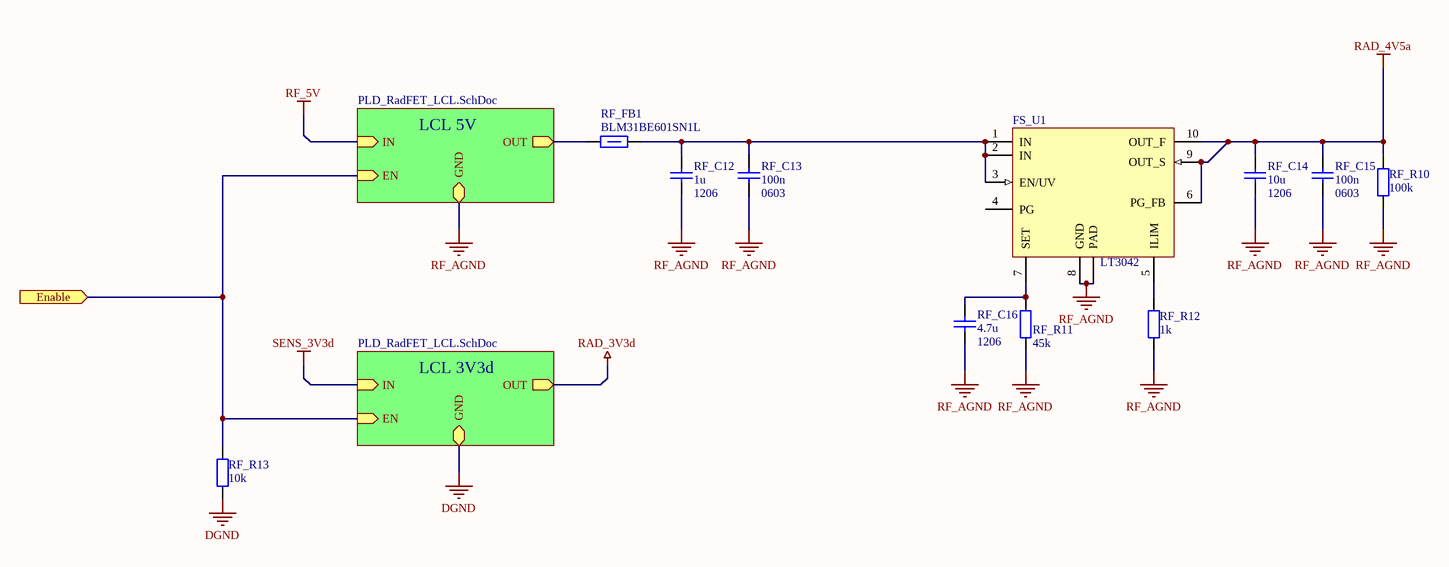
[diagram p5: PLD_RadFET_Supply.SchDoc]

### Parts
FS_U1  LT3042  [MSOP-10-M-thermal-pad]
RF_C12  value 1u  Package: 1206  [SMD_Capacitor_1206]  (hidden comment: Cap)
RF_C13  value 100n  Package: 0603  [SMD_Capacitor_0603]  (hidden comment: Cap)
RF_C14  value 10u  Package: 1206  [SMD_Capacitor_1206]  (hidden comment: Cap)
RF_C15  value 100n  Package: 0603  [SMD_Capacitor_0603]  (hidden comment: Cap)
RF_C16  value 4.7u  Package: 1206  [SMD_Capacitor_1206]  (hidden comment: Cap)
RF_FB1  ManufacturerPartNumber: BLM31BE601SN1L  [1206]  (hidden comment: 600R/100MHz)
RF_R10  100k  [SMD_Resistor_0603]
RF_R11  45k  [SMD_Resistor_0603]
RF_R12  1k  [SMD_Resistor_0603]
RF_R13  10k  [SMD_Resistor_0603]

### Sub-sheets
LCL 3V3d = PLD_RadFET_LCL.SchDoc: GND, IN (in), EN (in), OUT (out)
LCL 5V = PLD_RadFET_LCL.SchDoc: GND, IN (in), EN (in), OUT (out)

### Ports
Enable (in)

### Nets
DGND: RF_R13.1 ; sheet LCL 3V3d/GND
RAD_4V5a: FS_U1.6(PG_FB) FS_U1.9(OUT_S) FS_U1.10(OUT_F) RF_C14.1 RF_C15.1 RF_R10.2
RF_AGND: FS_U1.8(GND) FS_U1.11(PAD) RF_C12.2 RF_C13.2 RF_C14.2 RF_C15.2 RF_C16.2 RF_R10.1 RF_R11.1 RF_R12.1 ; sheet LCL 5V/GND
RadFET_EN: RF_R13.2 ; port Enable, sheet LCL 5V/EN, sheet LCL 3V3d/EN
NetFS_U1_1: FS_U1.1(IN) FS_U1.2(IN) FS_U1.3(EN/UV) RF_C12.1 RF_C13.1 RF_FB1.1
NetFS_U1_5: FS_U1.5(ILIM) RF_R12.2
NetFS_U1_7: FS_U1.7(SET) RF_C16.1 RF_R11.2
NetRF_FB1_2: RF_FB1.2 ; sheet LCL 5V/OUT

Not connected (* = marked no-connect by the designer): FS_U1 4(PG)

### Notes on the sheet
- Title:
- Project:
- Author:
- Model:
- Document Number:
- Checked by:
- Rev:
- Date:
- Approved by:
- Sheet:
- of
- File name:

### Library data of the parts
FS_U1 = LT3042: 20V, 200mA, Ultralow Noise, Ultrahigh PSRR RF Linear Regulator; PartNumber: LT3042; ComponentLink1Description: Manufacturer URL; ComponentLink1URL: http://www.linear.com/; ComponentLink2Description: Datasheet; ComponentLink2URL: http://cds.linear.com/docs/en/datasheet/3042fa.pdf
RF_FB1 = FerriteBead: Ferrite Bead; Manufacturer: Murata; HelpUrl: http://www.mouser.com/ds/2/281/c31e-794748.pdf; Supplier 1: Mouser; Value: 600R/100MHz; Mouser: 81-BLM31B601S
RF_R10-RF_R13 = Res: Package: 0603
  RF_R10: Value: 100k
  RF_R11: Value: 45k
  RF_R12: Value: 1k
  RF_R13: Value: 10k

## Sheet PLD_RadFET_LCL.SchDoc: Local Supply
size A4; ApprovedBy: Piotr Kuligowski; CheckedBy: Michal Gumiela; Author: Grzegorz Gajoch; DocumentNumber: PWSat2-xxx-DW-xxx; Revision: 1; SheetTotal: 32; Model: DM1
Used 2 times, as channels PLD Top/RadFET/Radfet Supply/LCL 5V, PLD Top/RadFET/Radfet Supply/LCL 3V3d. Parts and nets are listed once, with the designators drawn on the sheet.
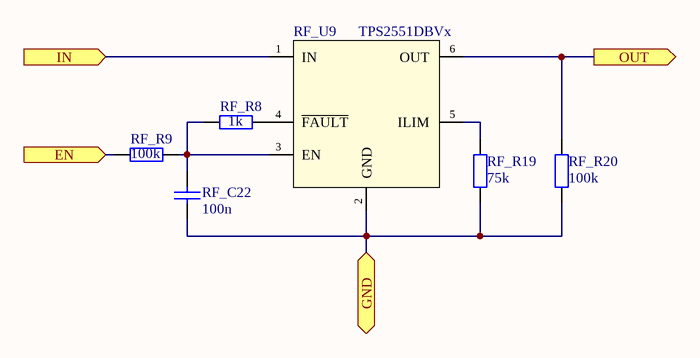
[diagram p6: PLD_RadFET_LCL.SchDoc]

### Parts
RF_C22  value 100n  [SMD_Capacitor_0603]  (hidden comment: Cap)
RF_R8  1k  [SMD_Resistor_0603]
RF_R9  100k  [SMD_Resistor_0603]
RF_R19  75k  [SMD_Resistor_0603]
RF_R20  100k  [SMD_Resistor_0603]
RF_U9  TPS2551DBVx  [SOT23-6]

### Ports
EN (in), GND, IN (in), OUT (out)

### Nets
EN: RF_R9.2 ; port EN
GND: RF_C22.2 RF_R19.1 RF_R20.1 RF_U9.2(GND) ; port GND
IN: RF_U9.1(IN) ; port IN
OUT: RF_R20.2 RF_U9.6(OUT) ; port OUT
NetRF_C22_1: RF_C22.1 RF_R8.2 RF_R9.1 RF_U9.3(EN)
NetRF_R8_1: RF_R8.1 RF_U9.4(~{FAULT})
NetRF_R19_2: RF_R19.2 RF_U9.5(ILIM)

### Channels
PLD Top/RadFET/Radfet Supply/LCL 5V: designators end in _LCL_5V; ports EN=RadFET_EN GND=RF_AGND IN=RF_5V OUT=NetRF_FB1_2
PLD Top/RadFET/Radfet Supply/LCL 3V3d: designators end in _LCL_3V3d; ports EN=RadFET_EN GND=DGND IN=SENS_3V3d OUT=RAD_3V3d

### Notes on the sheet
- Title:
- Project:
- Author:
- Model:
- Document Number:
- Checked by:
- Rev:
- Date:
- Approved by:
- Sheet:
- of
- File name:

### Library data of the parts
RF_R8 RF_R9 RF_R19 RF_R20 = Res: Package: 0603
  RF_R8: Value: 1k
  RF_R9 RF_R20: Value: 100k
  RF_R19: Value: 75k
RF_U9 = TPS2551DBVx: Adjustable Current-Limited Power-Distribution Switch.; Manufacturer: Texas Instruments; Value: TPS2551DBVx
RF_C22 = Cap: Package: 0603

## Sheet PLD_RadFET_ADC.SchDoc: A 24-bit AD7714YRZ Analog-to-Digital Converter
size A4; ApprovedBy: Piotr Kuligowski; CheckedBy: Michal Gumiela; Author: Grzegorz Gajoch; DocumentNumber: PWSat2-xxx-DW-xxx; Revision: 1; SheetTotal: 32; PageSetup: Record=PageOptions|CenterHorizontal=True|CenterVertical=True|PrintScale=1.00|XCorrection=1.00|YCorrection=1.00|PrintKind=0|BorderSize=5000000|LeftOffset=0|BottomOffset=0|Orientation=2|PaperLength=1000|PaperWidth=1000|Scale=100|PaperSource=7|PrintQuality=-3|MediaType=1|DitherType=10|PrintScaleMode=1|PaperKind=A4|PaperIndex=9; Model: DM1
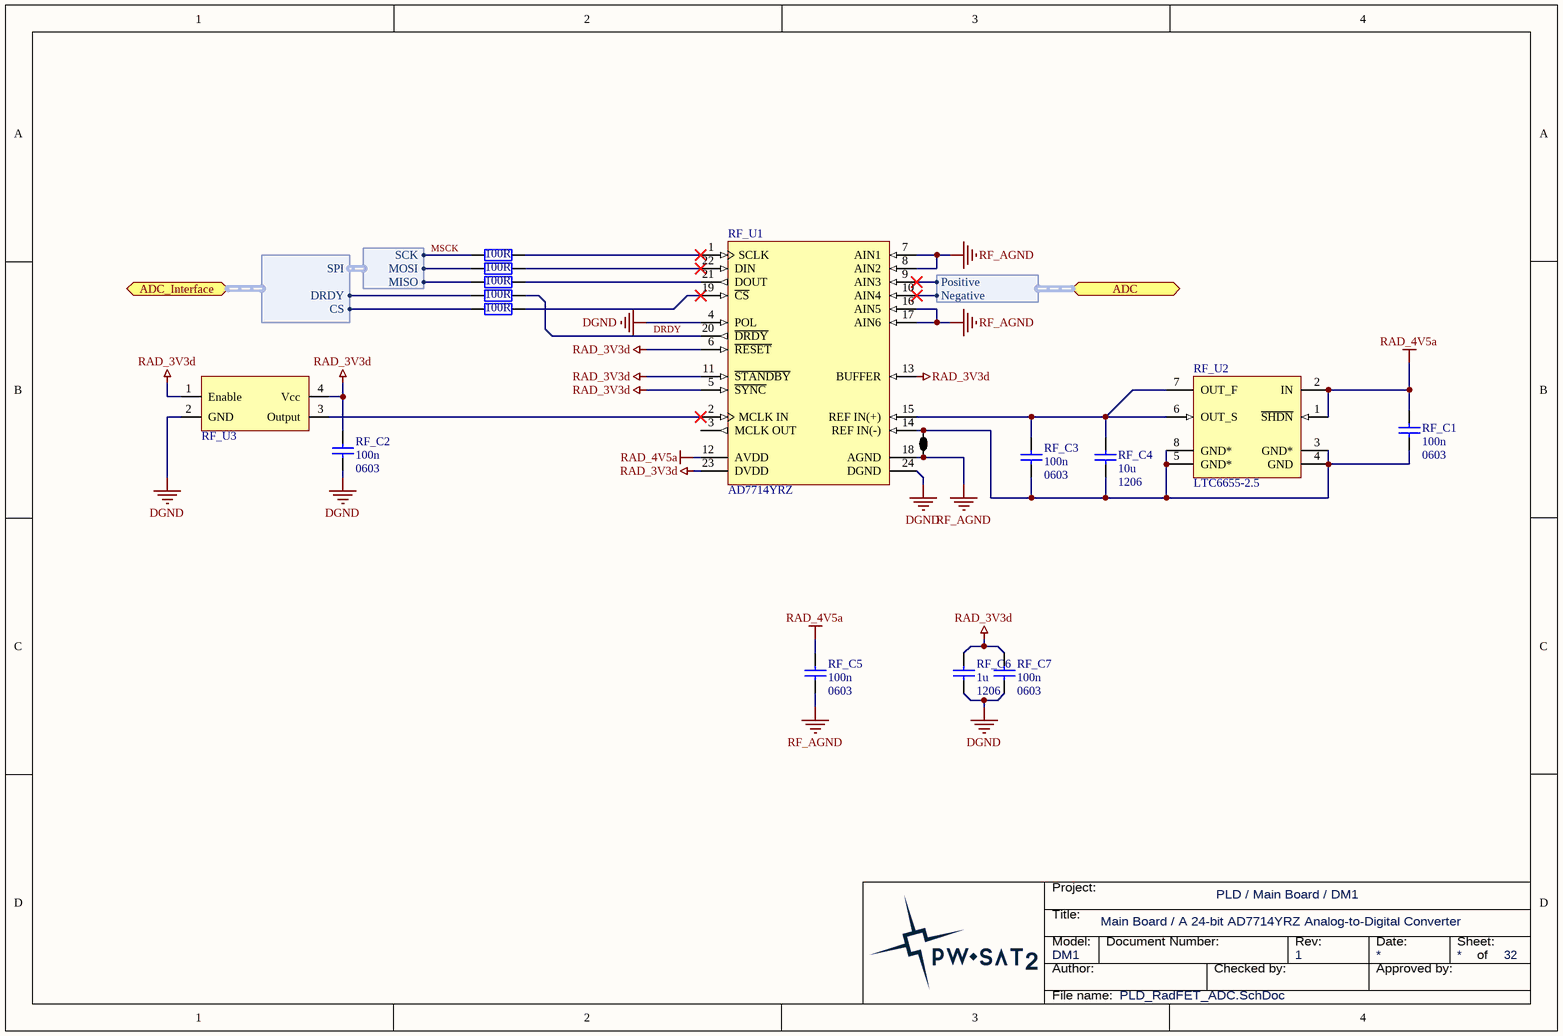
[diagram p7: PLD_RadFET_ADC.SchDoc]

### Parts
ADC_J2  2 way net tie junction  [2way_LP]  (value not drawn)  (net tie, no BOM)
RF_C1  value 100n  Package: 0603  [SMD_Capacitor_0603]  (hidden comment: Cap)
RF_C2  value 100n  Package: 0603  [SMD_Capacitor_0603]  (hidden comment: Cap)
RF_C3  value 100n  Package: 0603  [SMD_Capacitor_0603]  (hidden comment: Cap)
RF_C4  value 10u  Package: 1206  [SMD_Capacitor_1206]  (hidden comment: Cap)
RF_C5  value 100n  Package: 0603  [SMD_Capacitor_0603]  (hidden comment: Cap)
RF_C6  value 1u  Package: 1206  [SMD_Capacitor_1206]  (hidden comment: Cap)
RF_C7  value 100n  Package: 0603  [SMD_Capacitor_0603]  (hidden comment: Cap)
RF_R1  100R  [SMD_Resistor_0603]
RF_R2  100R  [SMD_Resistor_0603]
RF_R25  100R  [SMD_Resistor_0603]
RF_R26  100R  [SMD_Resistor_0603]
RF_R27  100R  [SMD_Resistor_0603]
RF_U1  AD7714YRZ  [TSSOP-24-RU-24-N]
RF_U2  LTC6655-2.5  [MSOP-8]
RF_U3  Ceramic Crystal  [2.0 x 2.5 mm]  (value not drawn)

### Ports
ADC (harness ADC Channel), ADC_Interface (harness ADC_DIGITAL)

### Harnesses
ADC_DIGITAL: DRDY, CS, SPI
SPI: SCK, MOSI, MISO
ADC Channel: Positive, Negative

### Nets
DGND: RF_C2.2 RF_C6.2 RF_C7.2 RF_U1.4(POL) RF_U1.24(DGND) RF_U3.2(GND)
RAD_3V3d: RF_C2.1 RF_C6.1 RF_C7.1 RF_U1.5(~{SYNC}) RF_U1.6(~{RESET}) RF_U1.11(~{STANDBY}) RF_U1.13(BUFFER) RF_U1.23(DVDD) RF_U3.1(Enable) RF_U3.4(Vcc)
RAD_4V5a: RF_C1.1 RF_C5.1 RF_U1.12(AVDD) RF_U2.1(~{SHDN}) RF_U2.2(IN)
RF_AGND: ADC_J2.1 RF_C5.2 RF_U1.7(AIN1) RF_U1.8(AIN2) RF_U1.16(AIN5) RF_U1.17(AIN6) RF_U1.18(AGND)
AD7714_~{CS}: RF_R27.1 ; port ADC_Interface.CS
AD7714_DRDY: RF_R26.1 ; port ADC_Interface.DRDY
DRDY: RF_R26.2 RF_U1.20(~{DRDY})
MSCK: RF_R1.1 ; harness SPI.SCK
RadFET_MISO: RF_R25.1 ; harness SPI.MISO
RadFET_MOSI: RF_R2.1 ; harness SPI.MOSI
NetADC_J2_2: ADC_J2.2 RF_C1.2 RF_C3.2 RF_C4.2 RF_U1.14(REF_IN(-)) RF_U2.3(GND*) RF_U2.4(GND) RF_U2.5(GND*) RF_U2.8(GND*)
NetRF_C3_1: RF_C3.1 RF_C4.1 RF_U1.15(REF_IN(+)) RF_U2.6(OUT_S) RF_U2.7(OUT_F)
NetRF_C17_2: RF_U1.9(AIN3) ; port ADC.Positive
NetRF_C18_2: RF_U1.10(AIN4) ; port ADC.Negative
NetRF_R1_2: RF_R1.2 RF_U1.1(SCLK)
NetRF_R2_2: RF_R2.2 RF_U1.22(DIN)
NetRF_R25_2: RF_R25.2 RF_U1.21(DOUT)
NetRF_R27_2: RF_R27.2 RF_U1.19(~{CS})
NetRF_U1_2: RF_U1.2(MCLK_IN) RF_U3.3(Output)

Not connected (* = marked no-connect by the designer): RF_U1 3(MCLK_OUT)

### Notes on the sheet
- Title:
- Project:
- Author:
- Model:
- Document Number:
- Checked by:
- Rev:
- Date:
- Approved by:
- Sheet:
- of
- File name:

### Library data of the parts
ADC_J2 = 2way: ComponentLink1URL: http://www.edatools.cz/addons; ComponentLink1Description: Source; FootprintNote: LP=12mil, MP=40mil, HP=120mil
RF_R1 RF_R2 RF_R25-RF_R27 = Res: Value: 100R; Package: 0603
RF_U1 = AD7714YRZ: 5 Channel 24-Bit Signal Conditioning Analog-to-Digital Converter with Serial, SPI Interface, 500 uA, CMOS, 3 V / 5 V, 1KSPS, -40 to +105 degC, RW-24, Pb-Free, Tube; Generic Part Number: AD7714; Manufacturer: Analog Devices; Resolution (Bits): 24; Channels: 5; Throughput Rate (SPS): 1K; Interface: Ser, SPI; DatasheetVersion: Rev.C; PackageVersion: 060706-A; PackageReference: RW-24; PackageDescription: 24-Lead Standard Small Outline Package [SOIC_W]; Supplier 1: Digi-Key; Supplier Part Number 1: AD7714YRZ-ND; Supplier 2: Farnell; Supplier Part Number 2: 1438858; Supplier 3: Newark; Supplier Part Number 3: 15P0854; Supplier 4: Newark; Supplier Part Number 4: 59K5335; Supplier 5: Mouser; Supplier Part Number 5: 584-AD7714YRZ; RoHS: Y; Packing: Tube; Mounting Technology: Surface Mount; Code_JEDEC: MS-013-AD; PartNumber: AD7714YRZ; ComponentLink1Description: Manufacturer URL; ComponentLink1URL: http://www.analog.com/en/index.html; ComponentLink2Description: Datasheet; ComponentLink2URL: http://www.analog.com/static/imported-files/data_sheets/AD7714.pdf; ComponentLink3Description: Package Specification; ComponentLink3URL: http://www.analog.com/static/imported-files/packages/33665150946139RW_24.pdf; ComponentLink4Description: Product URL; ComponentLink4URL: http://www.analog.com/en/analog-to-digital-converters/ad-converters/ad7714/products/product.html
RF_U2 = LTC6655-2.5: 0.25ppm Noise, Low Drift  Precision References; PartNumber: LTC6655-2.5; ComponentLink1Description: Manufacturer URL; ComponentLink1URL: http://www.linear.com/; ComponentLink2Description: Datasheet; ComponentLink2URL: http://cds.linear.com/docs/en/datasheet/6655fe.pdf
RF_U3 = ISM95-3351AH-1.0000: Ceramic Crystal 1 MHz, A-Grade 25 ppm/deg

## Sheet PLD_RadFET_Current_Source.SchDoc: Voltage adjustable current source
size A4; ApprovedBy: Piotr Kuligowski; CheckedBy: Michal Gumiela; Author: Grzegorz Gajoch; DocumentNumber: PWSat2-xxx-DW-xxx; Revision: 1; SheetTotal: 32; Model: DM1
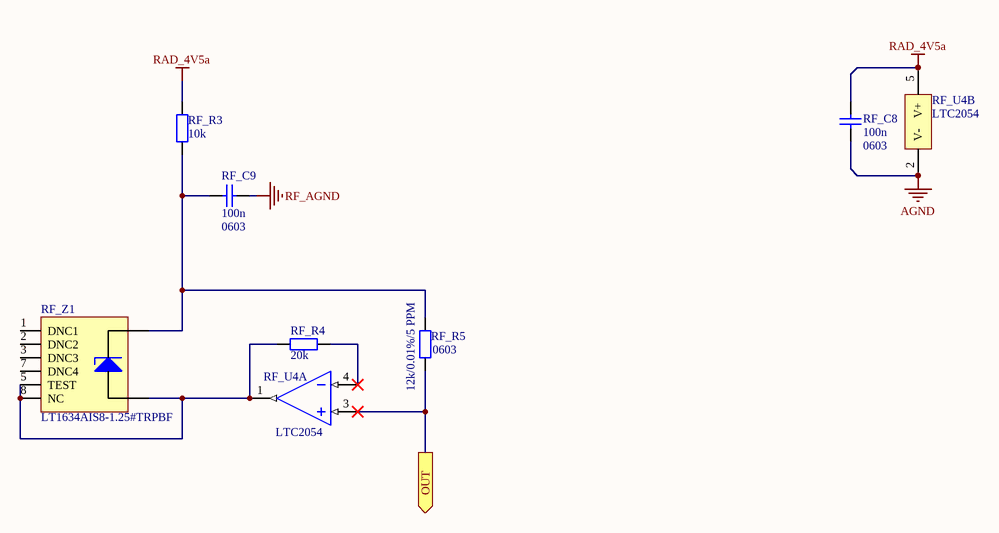
[diagram p8: PLD_RadFET_Current_Source.SchDoc]

### Parts
RF_C8  value 100n  Package: 0603  [SMD_Capacitor_0603]  (hidden comment: Cap)
RF_C9  value 100n  Package: 0603  [SMD_Capacitor_0603]  (hidden comment: Cap)
RF_R3  10k  [SMD_Resistor_0603]
RF_R4  20k  [SMD_Resistor_0603]
RF_R5  Package: 0603  [SMD_Resistor_0603]  (hidden comment: 12k/0.01%/5 PPM)
RF_U4  LTC2054  [SOT23-5]  (parts A,B of 2)
RF_Z1  1.25V  [SOIC-8-N]  (value not drawn)

### Ports
OUT (out)

### Nets
AGND: RF_C8.2 RF_U4.2(V-)
RAD_4V5a: RF_C8.1 RF_R3.1 RF_U4.5(V+)
RF_AGND: RF_C9.1
JFET_CURRENT: RF_R5.2 RF_U4.3(IN+_A) ; port OUT
NetRF_C9_2: RF_C9.2 RF_R3.2 RF_R5.1 RF_Z1.6(K)
NetRF_R4_1: RF_R4.1 RF_U4.1(OUT_A) RF_Z1.4(A) RF_Z1.5(TEST) RF_Z1.8(NC)
NetRF_R4_2: RF_R4.2 RF_U4.4(IN-_A)

Not connected (* = marked no-connect by the designer): RF_Z1 1(DNC1) 2(DNC2) 3(DNC3) 7(DNC4)

### Notes on the sheet
- Title:
- Project:
- Author:
- Model:
- Document Number:
- Checked by:
- Rev:
- Date:
- Approved by:
- Sheet:
- of
- File name:

### Library data of the parts
RF_R3-RF_R5 = Res
  RF_R3: Value: 10k; Package: 0603
  RF_R4: Value: 20k; Package: 0603
  RF_R5: Value: 12k/0.01%/5 PPM
RF_U4 = LTC2054: Single/Dual Micropower  Zero-Drift Operational Amplifi ers; Manufacturer: Linear Technology; Value: LTC2054
RF_Z1 = LT1634AIS8-1.25#TRPBF: Micropower Precision  Shunt Voltage Reference; Manufacturer: Linear; Value: 1.25V; ManufacturerPartNumber: LT1634AIS8-1.25#TRPBF

## Sheet PLD_RadFET_Mux.SchDoc: A 24-bit AD7714YRZ Analog-to-Digital Converter
size A4; ApprovedBy: Piotr Kuligowski; CheckedBy: Michal Gumiela; Author: Grzegorz Gajoch; DocumentNumber: PWSat2-xxx-DW-xxx; Revision: 1; SheetTotal: 32; Model: DM1
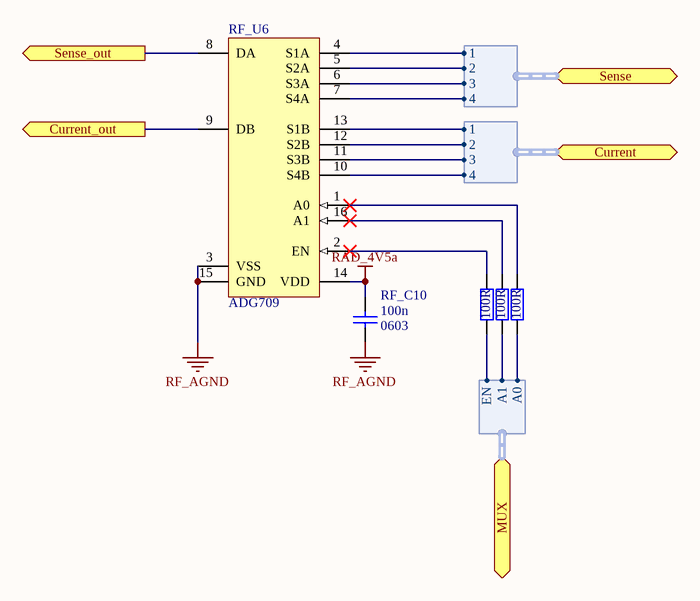
[diagram p9: PLD_RadFET_Mux.SchDoc]

### Parts
RF_C10  value 100n  Package: 0603  [SMD_Capacitor_0603]  (hidden comment: Cap)
RF_R6  100R  [SMD_Resistor_0603]
RF_R23  100R  [SMD_Resistor_0603]
RF_R24  100R  [SMD_Resistor_0603]
RF_U6  ADG709  [TSSOP16]

### Ports
Current (harness ADG709_MUX_CH), Current_out (out), MUX (harness ADG709_MUX), Sense (harness ADG709_MUX_CH), Sense_out (out)

### Harnesses
ADG709_MUX: A0, A1, EN
ADG709_MUX_CH: 1, 2, 3, 4
ADG709_MUX_CH: 2, 3, 4, 1

### Nets
RAD_4V5a: RF_C10.1 RF_U6.14(VDD)
RF_AGND: RF_C10.2 RF_U6.3(VSS) RF_U6.9(DB) RF_U6.15(GND) ; port Current_out
C_DIODE_0-2: RF_U6.4(S1A) RF_U6.13(S1B) ; port Sense.1, port Current.1
C_MOS_0: RF_U6.6(S3A) RF_U6.11(S3B) ; port Sense.3, port Current.3
C_MOS_1: RF_U6.7(S4A) RF_U6.10(S4B) ; port Sense.4, port Current.4
C_MOS_2: RF_U6.5(S2A) RF_U6.12(S2B) ; port Sense.2, port Current.2
RadFET_MUX_A0: RF_R24.1 ; port MUX.A0
RadFET_MUX_A1: RF_R6.1 ; port MUX.A1
RadFET_MUX_EN: RF_R23.1 ; port MUX.EN
NetRF_R6_2: RF_R6.2 RF_U6.16(A1)
NetRF_R15_1: RF_U6.8(DA) ; port Sense_out
NetRF_R23_2: RF_R23.2 RF_U6.2(EN)
NetRF_R24_2: RF_R24.2 RF_U6.1(A0)

### Notes on the sheet
- Title:
- Project:
- Author:
- Model:
- Document Number:
- Checked by:
- Rev:
- Date:
- Approved by:
- Sheet:
- of
- File name:

### Library data of the parts
RF_R6 RF_R23 RF_R24 = Res: Value: 100R; Package: 0603
RF_U6 = ADG709: CMOS Analog 4-Channel Multiplexer; Manufacturer: Analog Devices; ManufacturerPartNumber: ADG709

## Sheet PLD_RadFET_Sensor.SchDoc: 24-bit AD7714YRZ Analog-to-Digital Converter
size A4; ApprovedBy: Piotr Kuligowski; CheckedBy: Michal Gumiela; Author: Grzegorz Gajoch; DocumentNumber: PWSat2-xxx-DW-xxx; Revision: 1; SheetTotal: 32; Model: DM1
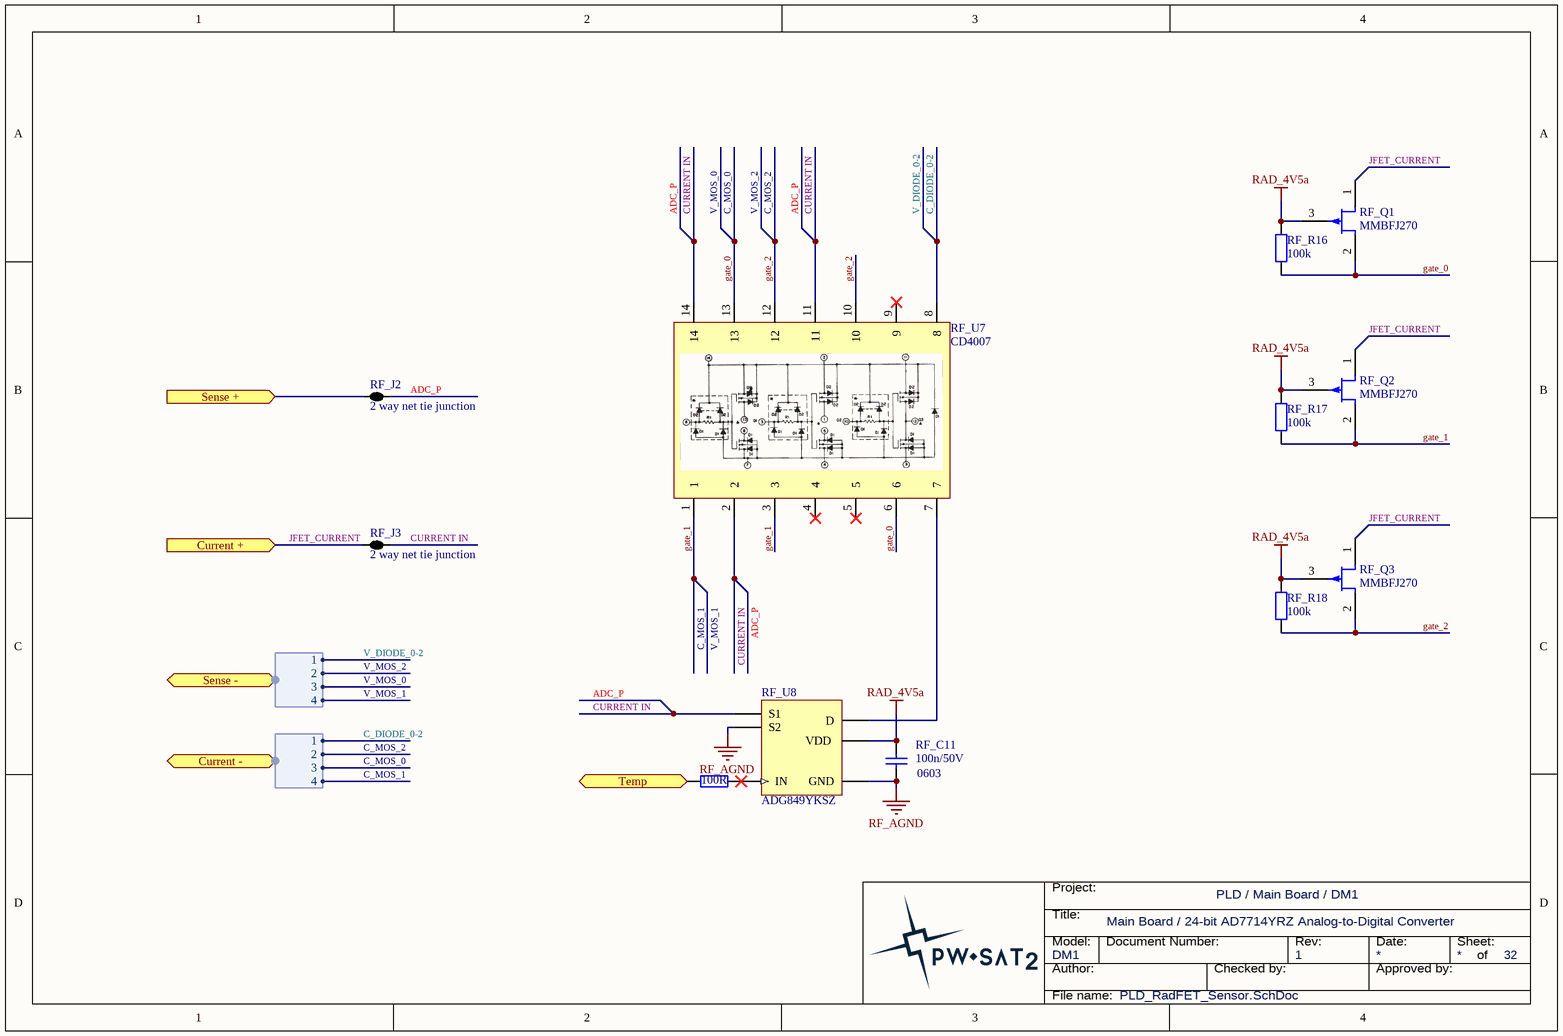
[diagram p10: PLD_RadFET_Sensor.SchDoc]

### Parts
RF_C11  Package: 0603  [SMD_Capacitor_0603]  (hidden comment: 100n/50V)
RF_J2  2 way net tie junction  [2way_LP]  (net tie, no BOM)
RF_J3  2 way net tie junction  [2way_LP]  (net tie, no BOM)
RF_Q1  MMBFJ270  [SOT23-3]
RF_Q2  MMBFJ270  [SOT23-3]
RF_Q3  MMBFJ270  [SOT23-3]
RF_R7  100R  [SMD_Resistor_0603]
RF_R16  100k  [SMD_Resistor_0603]
RF_R17  100k  [SMD_Resistor_0603]
RF_R18  100k  [SMD_Resistor_0603]
RF_U7  CD4007  [TSSOP14]
RF_U8  ADG849YKSZ  [SC70-LT6_N]

### Ports
Current + (in), Current - (harness ADG709_MUX_CH), Sense + (in), Sense - (harness ADG709_MUX_CH), Temp (in)

### Harnesses
ADG709_MUX_CH: 1, 2, 3, 4

### Nets
RAD_4V5a: RF_C11.1 RF_Q1.3(G) RF_Q2.3(G) RF_Q3.3(G) RF_R16.2 RF_R17.2 RF_R18.2 RF_U8.2(VDD)
RF_AGND: RF_C11.2 RF_U8.3(GND) RF_U8.6(S2)
ADC_P: RF_J2.2 RF_J3.2 RF_U7.2 RF_U7.11 RF_U7.14 RF_U8.4(S1)  [also labelled CURRENT IN]
C_DIODE_0-2: RF_U7.8 ; port Sense -.1, port Current -.1  [also labelled V_DIODE_0-2]
C_MOS_0: RF_Q1.2(S) RF_R16.1 RF_U7.6 RF_U7.13 ; port Sense -.3, port Current -.3  [also labelled gate_0, V_MOS_0]
C_MOS_1: RF_Q2.2(S) RF_R17.1 RF_U7.1 RF_U7.3 ; port Sense -.4, port Current -.4  [also labelled gate_1, V_MOS_1]
C_MOS_2: RF_Q3.2(S) RF_R18.1 RF_U7.10 RF_U7.12 ; port Sense -.2, port Current -.2  [also labelled gate_2, V_MOS_2]
JFET_CURRENT: RF_J3.1 RF_Q1.1(D) RF_Q2.1(D) RF_Q3.1(D) ; port Current +
RadFET_Temp_MUX: RF_R7.1 ; port Temp
NetRF_J2_1: RF_J2.1 ; port Sense +
NetRF_R7_2: RF_R7.2 RF_U8.1(IN)
NetRF_U7_7: RF_U7.7 RF_U8.5(D)

Not connected (* = marked no-connect by the designer): RF_U7 4* 5* 9*

### Notes on the sheet
- Title:
- Project:
- Author:
- Model:
- Document Number:
- Checked by:
- Rev:
- Date:
- Approved by:
- Sheet:
- of
- File name:

### Library data of the parts
RF_C11 = Cer_C0603T104K5RALTU: Ceramic Cap Kemet COTS 100n/50V X7R 0603; Manufacturer: Kemet; ManufacturerPartNumber: C0603T104K5RALTU; Value: 100n/50V
RF_J2 RF_J3 = 2way: ComponentLink1URL: http://www.edatools.cz/addons; ComponentLink1Description: Source; FootprintNote: LP=12mil, MP=40mil, HP=120mil
RF_Q1-RF_Q3 = MMBFJ270: JFET, P-Channel, 3-Pin SOT-23, Pb-Free, Tape and Reel; Manufacturer: On Semiconductor; PackageDescription: 3-Pin Small Outline Transistor, Body 2.92 x 1.3 mm, Pitch 0.95 mm; RoHS: Pb-Free; Mounting Technology: Surface Mount; PartNumber: MMBFJ270; ComponentLink1Description: Manufacturer URL; ComponentLink1URL: http://www.onsemi.com/; ComponentLink2Description: Datasheet; ComponentLink2URL: http://www.onsemi.com/pub_link/Collateral/MMBFJ177LT1-D.PDF; ComponentLink3Description: Package Specification
RF_R7 RF_R16-RF_R18 = Res: Package: 0603
  RF_R7: Value: 100R
  RF_R16-RF_R18: Value: 100k
RF_U7 = CD4007: CMOS Dual Complementary Pair Plus Inverter; ComponentLink1URL: http://www.mouser.com/catalog/specsheets/AT45DB041D.pdf; ComponentLink1Description: Datasheet
RF_U8 = ADG849YKSZ: CMOS Analog switch; Manufacturer: Analog Devices; ManufacturerPartNumber: ADG849YKSZ

## Sheet PLD_RadFET_Differential_Lowpass.SchDoc: Differential low-pass filter
size A4; ApprovedBy: Piotr Kuligowski; CheckedBy: Michal Gumiela; Author: Grzegorz Gajoch; DocumentNumber: PWSat2-xxx-DW-xxx; Revision: 1; SheetTotal: 32; Model: DM1
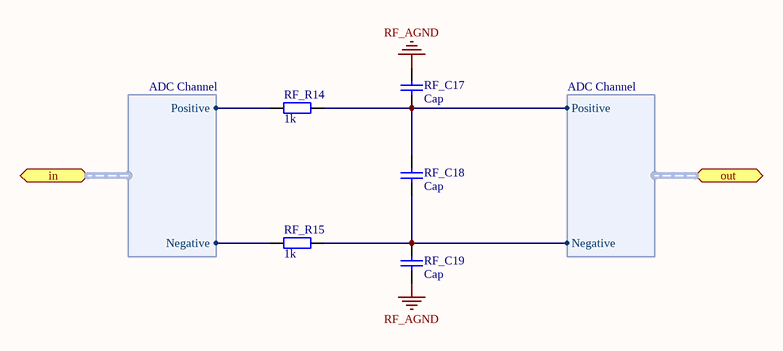
[diagram p11: PLD_RadFET_Differential_Lowpass.SchDoc]

### Parts
RF_C17  Cap  [SMD_Capacitor_0603]
RF_C18  Cap  [SMD_Capacitor_0603]
RF_C19  Cap  [SMD_Capacitor_0603]
RF_R14  1k  [SMD_Resistor_0603]
RF_R15  1k  [SMD_Resistor_0603]

### Ports
in (harness ADC Channel), out (harness ADC Channel)

### Harnesses
ADC Channel: Positive, Negative

### Nets
RF_AGND: RF_C17.1 RF_C19.2
NetRF_C17_2: RF_C17.2 RF_C18.1 RF_R14.2 ; port out.Positive
NetRF_C18_2: RF_C18.2 RF_C19.1 RF_R15.2 ; port out.Negative
NetRF_J2_1: RF_R14.1 ; port in.Positive
NetRF_R15_1: RF_R15.1 ; port in.Negative

### Notes on the sheet
- Title:
- Project:
- Author:
- Model:
- Document Number:
- Checked by:
- Rev:
- Date:
- Approved by:
- Sheet:
- of
- File name:

### Library data of the parts
RF_R14 RF_R15 = Res: Value: 1k; Package: 0603
RF_C17-RF_C19 = Cap: Value: Cap; Package: 0603

## Sheet PLD_Sail_interface.SchDoc: Latch Indicator Interface for Sail
size A4; ApprovedBy: Piotr Kuligowski; CheckedBy: Michal Gumiela; Author: Grzegorz Gajoch; DocumentNumber: PWSat2-xxx-DW-xxx; Revision: 1; SheetTotal: 32; Model: DM1
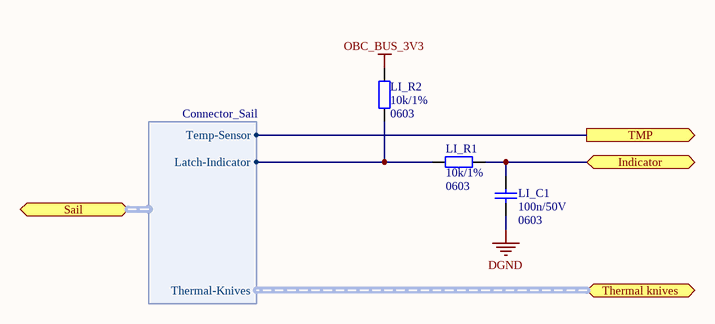
[diagram p12: PLD_Sail_interface.SchDoc]

### Parts
LI_C1  Package: 0603  [SMD_Capacitor_0603]  (hidden comment: 100n/50V)
LI_R1  Package: 0603  [SMD_Resistor_0603]  (hidden comment: 10k/1%)
LI_R2  Package: 0603  [SMD_Resistor_0603]  (hidden comment: 10k/1%)

### Ports
Indicator, Sail (harness Connector_Sail), Thermal knives (harness Sail_Thermal-Knives), TMP (out)

### Harnesses
Connector_Sail: Latch-Indicator, Temp-Sensor, Thermal-Knives

### Nets
DGND: LI_C1.1
OBC_BUS_3V3: LI_R2.1
Piggyback_ADC_PD4: LI_C1.2 LI_R1.2 ; port Indicator
PT1000_SAIL: port TMP, port Sail.Temp-Sensor
NetCONN_H2_4: LI_R1.1 LI_R2.2 ; port Sail.Latch-Indicator

### Notes on the sheet
- Title:
- Project:
- Author:
- Model:
- Document Number:
- Checked by:
- Rev:
- Date:
- Approved by:
- Sheet:
- of
- File name:

### Library data of the parts
LI_C1 = Cer_C0603T104K5RALTU: Ceramic Cap Kemet COTS 100n/50V X7R 0603; Manufacturer: Kemet; ManufacturerPartNumber: C0603T104K5RALTU; Value: 100n/50V
LI_R1 LI_R2 = CRCW060310K0FKxxxx: 10k/1% Vishay CRCW 0603 Resistor. 100mW, 100ppm, 75V.; Manufacturer: Vishay; ManufacturerPartNumber: CRCW060310K0FKxxxx; Value: 10k/1%

## Sheet PLD_Sensors_AVR_Interface.SchDoc: Gyroscopes Buffer
size A3; ApprovedBy: Piotr Kuligowski; CheckedBy: Michal Gumiela; Author: Grzegorz Gajoch; DocumentNumber: PWSat2-xxx-DW-xxx; Revision: 1; SheetTotal: 32; Model: DM1
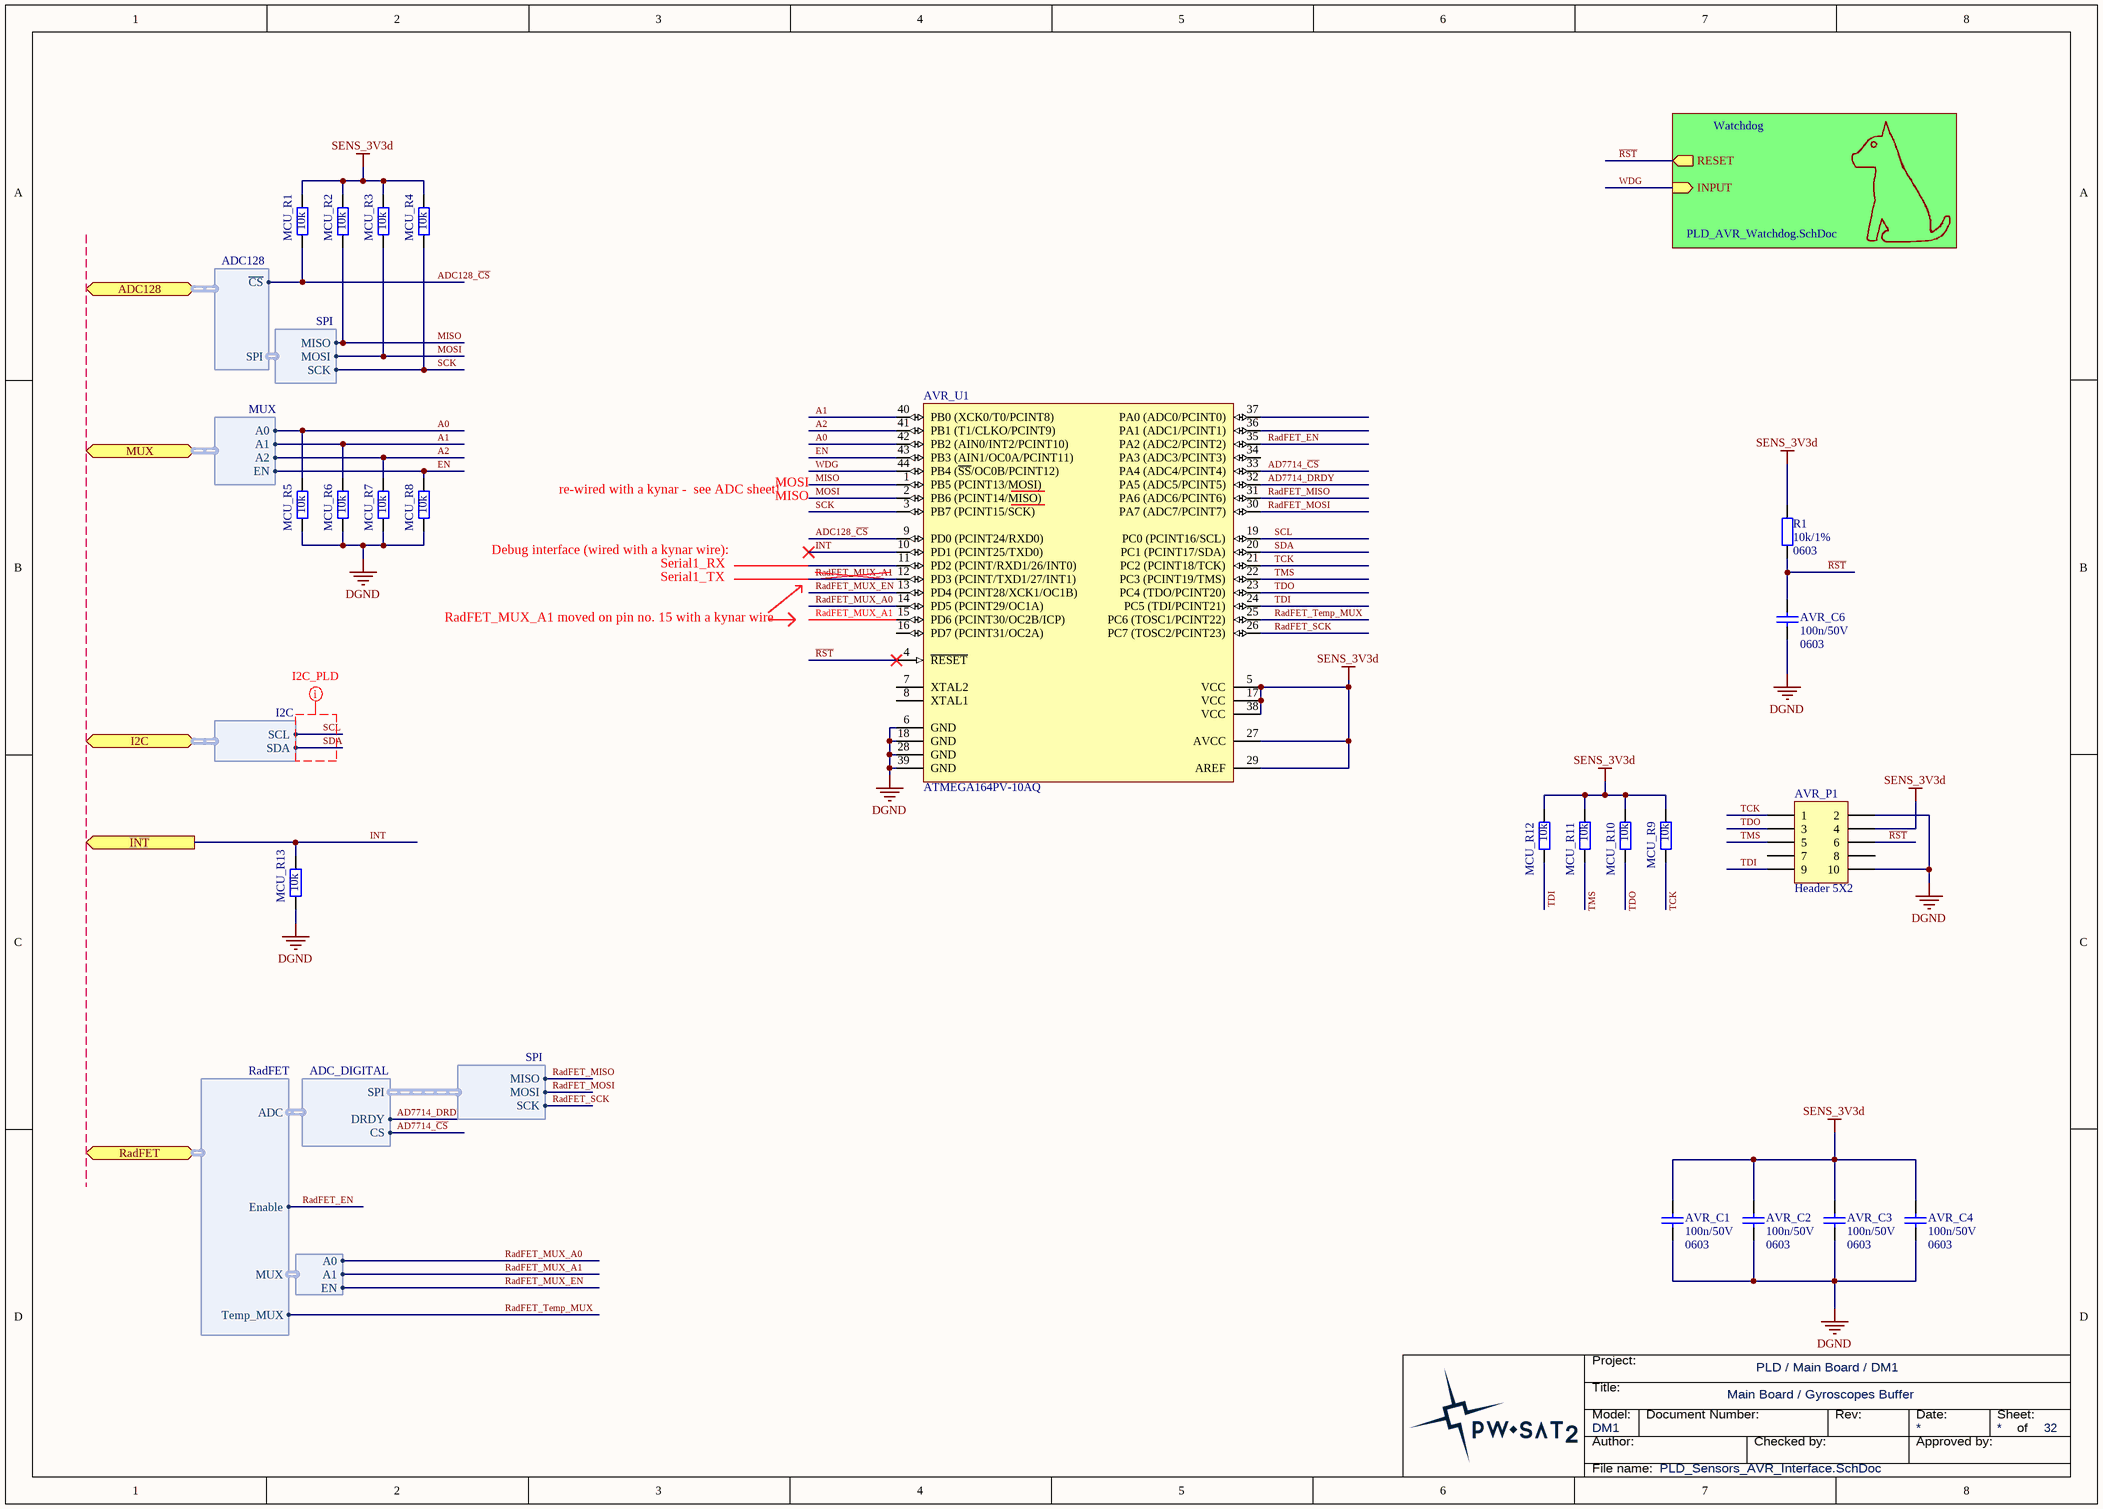
[diagram p13: PLD_Sensors_AVR_Interface.SchDoc]

### Parts
AVR_C1  Package: 0603  [SMD_Capacitor_0603]  (hidden comment: 100n/50V)
AVR_C2  Package: 0603  [SMD_Capacitor_0603]  (hidden comment: 100n/50V)
AVR_C3  Package: 0603  [SMD_Capacitor_0603]  (hidden comment: 100n/50V)
AVR_C4  Package: 0603  [SMD_Capacitor_0603]  (hidden comment: 100n/50V)
AVR_C6  Package: 0603  [SMD_Capacitor_0603]  (hidden comment: 100n/50V)
AVR_P1  Header 5X2  [HDR2X5]
AVR_U1  ATMEGA164PV-10AQ  [TQFP-44]
MCU_R1  10k  [SMD_Resistor_0603]
MCU_R2  10k  [SMD_Resistor_0603]
MCU_R3  10k  [SMD_Resistor_0603]
MCU_R4  10k  [SMD_Resistor_0603]
MCU_R5  10k  [SMD_Resistor_0603]
MCU_R6  10k  [SMD_Resistor_0603]
MCU_R7  10k  [SMD_Resistor_0603]
MCU_R8  10k  [SMD_Resistor_0603]
MCU_R9  10k  [SMD_Resistor_0603]
MCU_R10  10k  [SMD_Resistor_0603]
MCU_R11  10k  [SMD_Resistor_0603]
MCU_R12  10k  [SMD_Resistor_0603]
MCU_R13  10k  [SMD_Resistor_0603]
R1  Package: 0603  [SMD_Resistor_0603]  (hidden comment: 10k/1%)

### Sub-sheets
Watchdog = PLD_AVR_Watchdog.SchDoc: RESET (out), INPUT (in)

### Ports
ADC128 (harness ADC128), I2C (harness I2C), INT (out), MUX (harness MUX), RadFET (harness RadFET)

### Harnesses
I2C: SDA, SCL
SPI: MISO, MOSI, SCK
ADC128: SPI, ~{CS}
MUX: A0, A1, A2, EN
ADC_DIGITAL: DRDY, CS, SPI
ADG709_MUX: A0, A1, EN
RadFET: ADC, MUX, Enable, Temp_MUX

### Nets
DGND: AVR_C1.2 AVR_C2.2 AVR_C3.2 AVR_C4.2 AVR_C6.2 AVR_P1.2 AVR_P1.10 AVR_U1.6(GND) AVR_U1.18(GND) AVR_U1.28(GND) AVR_U1.39(GND) MCU_R5.1 MCU_R6.1 MCU_R7.1 MCU_R8.1 MCU_R13.2
SENS_3V3d: AVR_C1.1 AVR_C2.1 AVR_C3.1 AVR_C4.1 AVR_P1.4 AVR_U1.5(VCC) AVR_U1.17(VCC) AVR_U1.27(AVCC) AVR_U1.29(AREF) AVR_U1.38(VCC) MCU_R1.1 MCU_R2.1 MCU_R3.1 MCU_R4.1 MCU_R9.1 MCU_R10.1 MCU_R11.1 MCU_R12.1 R1.1
A0: AVR_U1.42(PB2_(AIN0/INT2/PCINT10)) MCU_R5.2 ; port MUX.A0
A1: AVR_U1.40(PB0_(XCK0/T0/PCINT8)) MCU_R6.2 ; port MUX.A1
A2: AVR_U1.41(PB1_(T1/CLKO/PCINT9)) MCU_R7.2 ; port MUX.A2
AD7714_~{CS}: AVR_U1.33(PA4_(ADC4/PCINT4)) ; harness ADC_DIGITAL.CS
AD7714_DRDY: AVR_U1.32(PA5_(ADC5/PCINT5)) ; harness ADC_DIGITAL.DRDY
ADC128_~{CS}: AVR_U1.9(PD0_(PCINT24/RXD0)) MCU_R1.2 ; port ADC128.~{CS}
EN: AVR_U1.43(PB3_(AIN1/OC0A/PCINT11)) MCU_R8.2 ; port MUX.EN
INT: AVR_U1.10(PD1_(PCINT25/TXD0)) MCU_R13.1 ; port INT
MISO: AVR_U1.1(PB5_(PCINT13/MOSI)) MCU_R2.2 ; harness SPI.MISO
MOSI: AVR_U1.2(PB6_(PCINT14/MISO)) MCU_R3.2 ; harness SPI.MOSI
~{RST}: AVR_C6.1 AVR_P1.6 AVR_U1.4(~{RESET}) R1.2 ; sheet Watchdog/RESET
RadFET_EN: AVR_U1.35(PA2_(ADC2/PCINT2)) ; port RadFET.Enable
RadFET_MISO: AVR_U1.31(PA6_(ADC6/PCINT6)) ; harness SPI.MISO
RadFET_MOSI: AVR_U1.30(PA7_(ADC7/PCINT7)) ; harness SPI.MOSI
RadFET_MUX_A0: AVR_U1.14(PD5_(PCINT29/OC1A)) ; harness ADG709_MUX.A0
RadFET_MUX_A1: AVR_U1.12(PD3_(PCINT/TXD1/27/INT1)) ; harness ADG709_MUX.A1
RadFET_MUX_EN: AVR_U1.13(PD4_(PCINT28/XCK1/OC1B)) ; harness ADG709_MUX.EN
RadFET_SCK: AVR_U1.26(PC7_(TOSC2/PCINT23)) ; harness SPI.SCK  [project net MSCK]
RadFET_Temp_MUX: AVR_U1.25(PC6_(TOSC1/PCINT22)) ; port RadFET.Temp_MUX
SCK: AVR_U1.3(PB7_(PCINT15/SCK)) MCU_R4.2 ; harness SPI.SCK
SCL: AVR_U1.19(PC0_(PCINT16/SCL)) ; port I2C.SCL
SDA: AVR_U1.20(PC1_(PCINT17/SDA)) ; port I2C.SDA
TCK: AVR_P1.1 AVR_U1.21(PC2_(PCINT18/TCK)) MCU_R9.2
TDI: AVR_P1.9 AVR_U1.24(PC5_(TDI/PCINT21)) MCU_R12.2
TDO: AVR_P1.3 AVR_U1.23(PC4_(TDO/PCINT20)) MCU_R10.2
TMS: AVR_P1.5 AVR_U1.22(PC3_(PCINT19/TMS)) MCU_R11.2
WDG: AVR_U1.44(PB4_(~{SS}/OC0B/PCINT12)) ; sheet Watchdog/INPUT

Not connected (* = marked no-connect by the designer): AVR_P1 7 8; AVR_U1 7(XTAL2) 8(XTAL1) 11(PD2_(PCINT/RXD1/26/INT0)) 15(PD6_(PCINT30/OC2B/ICP)) 16(PD7_(PCINT31/OC2A)) 34(PA3_(ADC3/PCINT3)) 36(PA1_(ADC1/PCINT1)) 37(PA0_(ADC0/PCINT0))

### Layout directives
net class I2C_PLD: SCL, SDA

### Notes on the sheet
- re-wired with a kynar -  see ADC sheet!
- MOSI
- MISO
- Debug interface (wired with a kynar wire):
- Serial1_RX
- Serial1_TX
- RadFET_MUX_A1 moved on pin no. 15 with a kynar wire
- (near AVR_U1) RadFET_MUX_A1
- Title:
- Project:
- Author:
- Model:
- Document Number:
- Checked by:
- Rev:
- Date:
- Approved by:
- Sheet:
- of
- File name:

### Library data of the parts
AVR_C1-AVR_C4 AVR_C6 = Cer_C0603T104K5RALTU: Ceramic Cap Kemet COTS 100n/50V X7R 0603; Manufacturer: Kemet; ManufacturerPartNumber: C0603T104K5RALTU; Value: 100n/50V
AVR_P1 = Header 5X2: Header, 5-Pin, Dual row; LatestRevisionDate: 17-Jul-2002; LatestRevisionNote: Re-released for DXP Platform.; Publisher: Altium Limited
AVR_U1 = ATMEGA164PV-10AQ: General-purpose microcontroller; Value: ATMEGA164PV-10AQ
MCU_R1-MCU_R13 = Res: Value: 10k; Package: 0603
R1 = CRCW060310K0FKxxxx: as LI_R1 on sheet PLD_Sail_interface; Manufacturer: Vishay; ManufacturerPartNumber: CRCW060310K0FKxxxx; Value: 10k/1%

## Sheet PLD_AVR_Watchdog.SchDoc: Watchdog for RadFET
size A4; ApprovedBy: Piotr Kuligowski; CheckedBy: Michal Gumiela; Author: Grzegorz Gajoch; DocumentNumber: PWSat2-xxx-DW-xxx; Revision: 1; SheetTotal: 32; Model: DM1
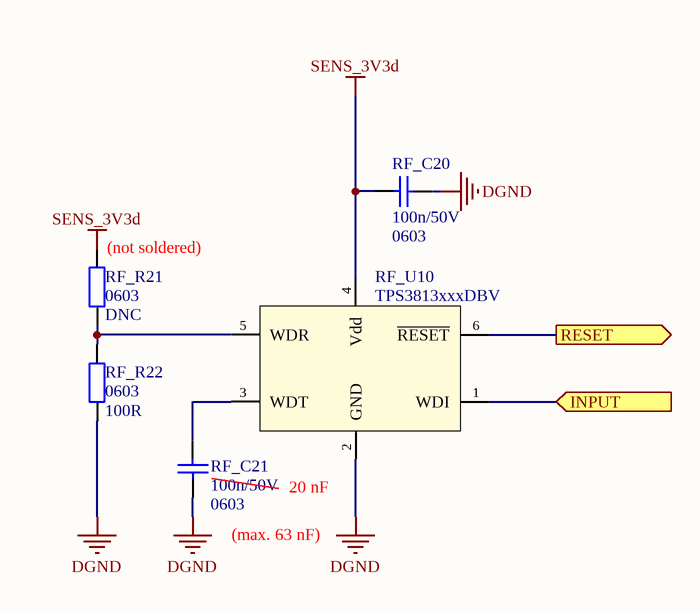
[diagram p14: PLD_AVR_Watchdog.SchDoc]

### Parts
RF_C20  Package: 0603  [SMD_Capacitor_0603]  (hidden comment: 100n/50V)
RF_C21  Package: 0603  [SMD_Capacitor_0603]  (hidden comment: 100n/50V)
RF_R21  0603  value DNC  [SMD_Resistor_0603]
RF_R22  0603  value 100R  [SMD_Resistor_0603]
RF_U10  TPS3813xxxDBV  [SOT23-6]

### Ports
INPUT (in), RESET (out)

### Nets
DGND: RF_C20.2 RF_C21.2 RF_R22.1 RF_U10.2(GND)
SENS_3V3d: RF_C20.1 RF_R21.2 RF_U10.4(Vdd)
~{RST}: RF_U10.6(~{RESET}) ; port RESET
WDG: RF_U10.1(WDI) ; port INPUT
NetRF_C21_1: RF_C21.1 RF_U10.3(WDT)
NetRF_R21_1: RF_R21.1 RF_R22.2 RF_U10.5(WDR)

### Notes on the sheet
- (near RF_R21) (not soldered)
- (max. 63 nF)
- (near RF_U10) 20 nF
- Title:
- Project:
- Author:
- Model:
- Document Number:
- Checked by:
- Rev:
- Date:
- Approved by:
- Sheet:
- of
- File name:

### Library data of the parts
RF_C20 RF_C21 = Cer_C0603T104K5RALTU: Ceramic Cap Kemet COTS 100n/50V X7R 0603; Manufacturer: Kemet; ManufacturerPartNumber: C0603T104K5RALTU; Value: 100n/50V
RF_R21 RF_R22 = Res2: Resistor; Published: 8-Jun-2000; LatestRevisionDate: 17-Jul-2002; LatestRevisionNote: Re-released for DXP Platform.; PackageReference: AXIAL-0.4; Publisher: Altium Limited; PackageDescription: Axial Device, Thru-Hole; 2 Leads; 0.4 in Pin Spacing
RF_U10 = TPS3813xxxDBV: Processor Supervisory Circuits with Window-Watchdog.; Manufacturer: Texas Instruments; Value: TPS3813xxxDBV

## Sheet PLD_Photodiodes.SchDoc: Photodiodes
size A3; ApprovedBy: Piotr Kuligowski; CheckedBy: Michal Gumiela; Author: Grzegorz Gajoch; DocumentNumber: PWSat2-xxx-DW-xxx; Revision: 1; SheetTotal: 32; Model: DM1
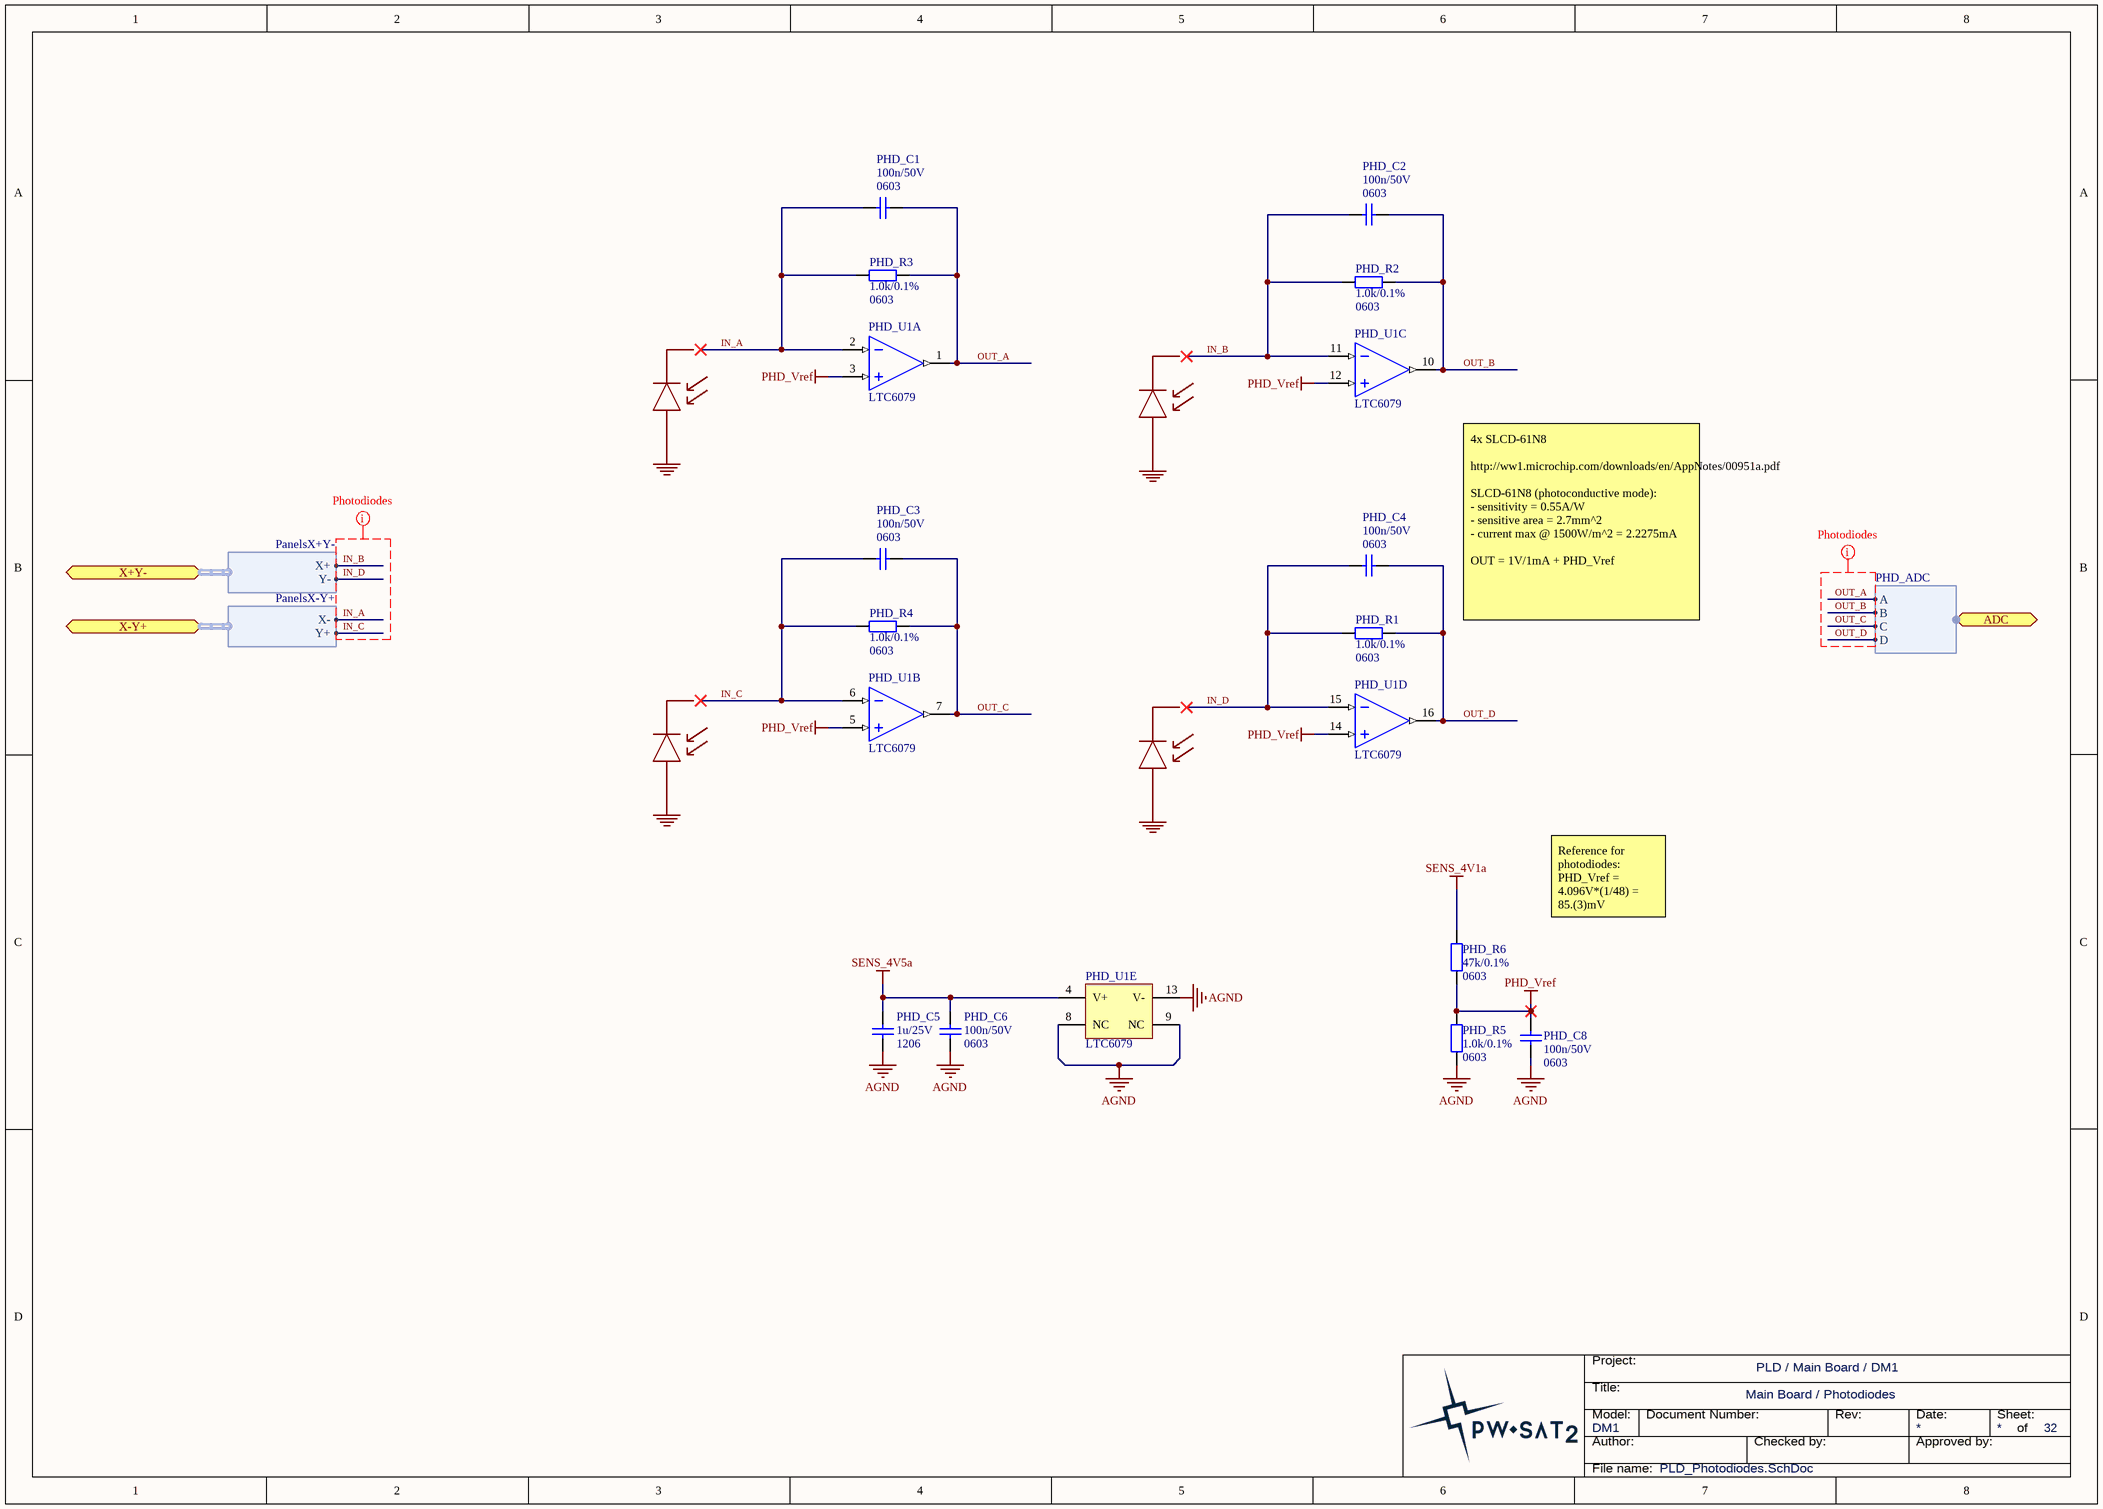
[diagram p15: PLD_Photodiodes.SchDoc]

### Parts
PHD_C1  Package: 0603  [SMD_Capacitor_0603]  (hidden comment: 100n/50V)
PHD_C2  Package: 0603  [SMD_Capacitor_0603]  (hidden comment: 100n/50V)
PHD_C3  Package: 0603  [SMD_Capacitor_0603]  (hidden comment: 100n/50V)
PHD_C4  Package: 0603  [SMD_Capacitor_0603]  (hidden comment: 100n/50V)
PHD_C5  Package: 1206  [SMD_Capacitor_1206]  (hidden comment: 1u/25V)
PHD_C6  Package: 0603  [SMD_Capacitor_0603]  (hidden comment: 100n/50V)
PHD_C8  Package: 0603  [SMD_Capacitor_0603]  (hidden comment: 100n/50V)
PHD_R1  Package: 0603  [SMD_Resistor_0603]  (hidden comment: 1.0k/0.1%)
PHD_R2  Package: 0603  [SMD_Resistor_0603]  (hidden comment: 1.0k/0.1%)
PHD_R3  Package: 0603  [SMD_Resistor_0603]  (hidden comment: 1.0k/0.1%)
PHD_R4  Package: 0603  [SMD_Resistor_0603]  (hidden comment: 1.0k/0.1%)
PHD_R5  Package: 0603  [SMD_Resistor_0603]  (hidden comment: 1.0k/0.1%)
PHD_R6  Package: 0603  [SMD_Resistor_0603]  (hidden comment: 47k/0.1%)
PHD_U1  LTC6079  [SSOP-16]  (parts A,B,C,D,E of 5)

### Ports
ADC (harness PHD_ADC), X+Y- (harness PanelsX+Y-), X-Y+ (harness PanelsX-Y+)

### Harnesses
PanelsX+Y-: X+, Y-
PanelsX-Y+: X-, Y+
PHD_ADC: A, B, C, D

### Nets
AGND: PHD_C5.2 PHD_C6.1 PHD_C8.2 PHD_R5.2 PHD_U1.8(NC) PHD_U1.9(NC) PHD_U1.13(V-)
PHD_Vref: PHD_C8.1 PHD_R5.1 PHD_R6.2 PHD_U1.3(IN+_A) PHD_U1.5(IN+_B) PHD_U1.12(IN+_C) PHD_U1.14(IN+_D)
SENS_4V1a: PHD_R6.1
SENS_4V5a: PHD_C5.1 PHD_C6.2 PHD_U1.4(V+)
IN_A: PHD_C1.1 PHD_R3.1 PHD_U1.2(IN-_A) ; port X-Y+.X-
IN_B: PHD_C2.1 PHD_R2.1 PHD_U1.11(IN-_C) ; port X+Y-.X+
IN_C: PHD_C3.1 PHD_R4.1 PHD_U1.6(IN-_B) ; port X-Y+.Y+
IN_D: PHD_C4.1 PHD_R1.1 PHD_U1.15(IN-_D) ; port X+Y-.Y-
OUT_A: PHD_C1.2 PHD_R3.2 PHD_U1.1(OUT_A) ; port ADC.A
OUT_B: PHD_C2.2 PHD_R2.2 PHD_U1.10(OUT_C) ; port ADC.B
OUT_C: PHD_C3.2 PHD_R4.2 PHD_U1.7(OUT_B) ; port ADC.C
OUT_D: PHD_C4.2 PHD_R1.2 PHD_U1.16(OUT_D) ; port ADC.D

### Layout directives
net class Photodiodes: IN_A, IN_B, IN_C, IN_D, OUT_A, OUT_B, OUT_C, OUT_D

### Notes on the sheet
- 4x SLCD-61N8
  http://ww1.microchip.com/downloads/en/AppNotes/00951a.pdf
  SLCD-61N8 (photoconductive mode):
  - sensitivity = 0.55A/W
  - sensitive area = 2.7mm^2
  - current max @ 1500W/m^2 = 2.2275mA
  OUT = 1V/1mA + PHD_Vref
- Reference for photodiodes:
  PHD_Vref = 4.096V*(1/48) = 85.(3)mV
- Title:
- Project:
- Author:
- Model:
- Document Number:
- Checked by:
- Rev:
- Date:
- Approved by:
- Sheet:
- of
- File name:

### Library data of the parts
PHD_C1-PHD_C4 PHD_C6 PHD_C8 = Cer_C0603T104K5RALTU: Ceramic Cap Kemet COTS 100n/50V X7R 0603; Manufacturer: Kemet; ManufacturerPartNumber: C0603T104K5RALTU; Value: 100n/50V
PHD_C5 = Cer_C1206T105K3RALTU: Ceramic Cap Kemet COTS 1u/25V X7R 1206; ManufacturerPartNumber: C1206T105K3RALTU; Manufacturer: Kemet; Value: 1u/25V
PHD_R1-PHD_R6 = Res
  PHD_R1-PHD_R5: Value: 1.0k/0.1%
  PHD_R6: Value: 47k/0.1%
PHD_U1 = LTC6079: Rail-to-rail, quad operational amplifier. Library compatible with LTC608X LTC607X op-amps; Manufacturer: Linear Technology; Value: LTC6079